# EAGLE design v2 (EAGLE 9.3.2)

## Sheet 1 of 6
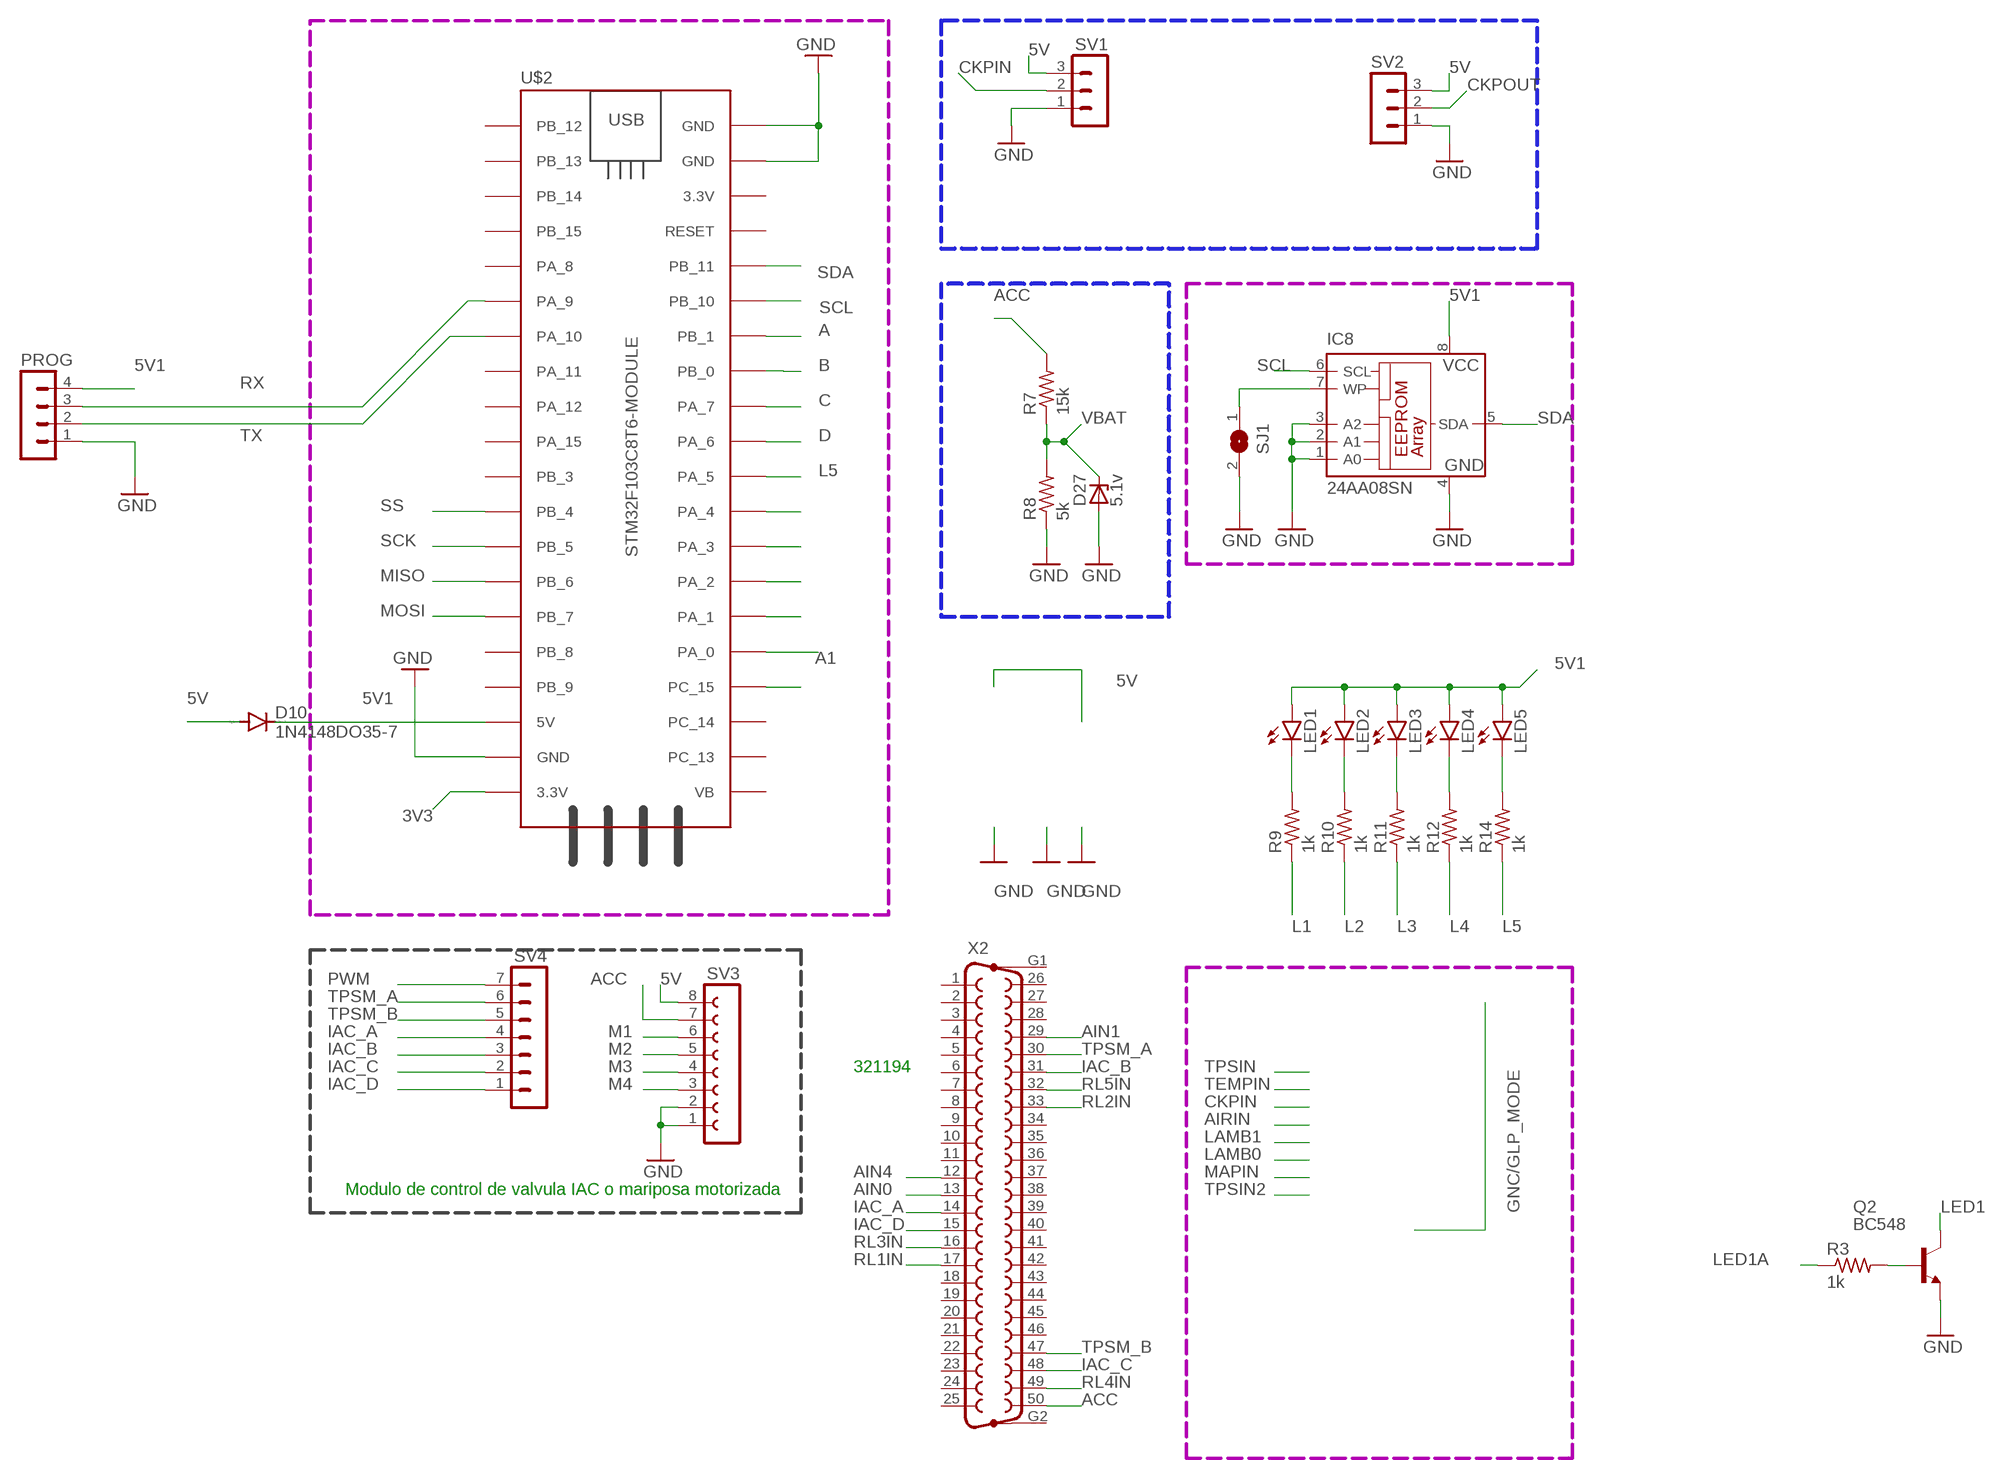
[diagram p0: schematic, sheet 1]

### Parts
D10  1N4148DO35-7  [DO35-7]
D27  5.1v  ZENER-DIODEZD-5  [ZDIO-5]
IC8  24AA08SN  [SO-08]
LED1  LED3MM  [LED3MM]
LED2  LED3MM  [LED3MM]
LED3  LED3MM  [LED3MM]
LED4  LED3MM  [LED3MM]
LED5  LED3MM  [LED3MM]
PROG  MA04-1  [MA04-1]
Q2  BC548  [TO92-EBC]
R3  1k  R-US_0204/5  [0204/5]
R7  15k  R-US_0204/5  [0204/5]
R8  5k  R-US_0204/5  [0204/5]
R9  1k  R-US_0204/5  [0204/5]
R10  1k  R-US_0204/5  [0204/5]
R11  1k  R-US_0204/5  [0204/5]
R12  1k  R-US_0204/5  [0204/5]
R14  1k  R-US_0204/5  [0204/5]
SJ1  SJW  [SJW]
SV1  MA03-1  [MA03-1]
SV2  MA03-1  [MA03-1]
SV3  FE08-1  [FE08]
SV4  MA07-1  [MA07-1]
U$2  STM32F103C8T6-MODULE  [STM32F103C8T6-MODULE]
X2  F50HP  [F50HP]

### Nets
3V3: U$2.3.3V_1(3.3V) ; also sheet 4
5V: D10.A SV1.3 SV2.3 SV3.8 ; also sheet 2,5,6
5V1: D10.C IC8.8(VCC) LED1.A LED2.A LED3.A LED4.A LED5.A PROG.4 U$2.5V
A: U$2.PB_1 ; also sheet 2
A1: U$2.PA_0 ; also sheet 4
ACC: R7.2 SV3.7 X2.50 ; also sheet 3,4,6
AIN0: X2.13 ; also sheet 5
AIN1: X2.29 ; also sheet 5
AIN4: X2.12 ; also sheet 5
B: U$2.PB_0 ; also sheet 2
C: U$2.PA_7 ; also sheet 2
CKPIN: SV1.2
CKPOUT: SV2.2 ; also sheet 2
D: U$2.PA_6 ; also sheet 2
GND: D27.A IC8.1(A0) IC8.2(A1) IC8.3(A2) IC8.4(GND) PROG.1 Q2.E R8.1 SJ1.2 SV1.1 SV2.1 SV3.1 SV3.2 U$2.GND_1(GND) U$2.GND_2(GND) U$2.GND_3(GND) ; also sheet 2,3,4,5,6
IAC_A: SV4.4 X2.14
IAC_B: SV4.3 X2.31
IAC_C: SV4.2 X2.48
IAC_D: SV4.1 X2.15
L1: R9.1
L2: R10.1
L3: R11.1
L4: R12.1
L5: R14.1 U$2.PA_5
LED1: Q2.C
LED1A: R3.1
M1: SV3.6 ; also sheet 2
M2: SV3.5 ; also sheet 2
M3: SV3.4 ; also sheet 2
M4: SV3.3 ; also sheet 2
MISO: U$2.PB_6 ; also sheet 2
MOSI: U$2.PB_7 ; also sheet 2
N$12: LED1.K(C) R9.2
N$13: LED2.K(C) R10.2
N$14: Q2.B R3.2
N$15: LED3.K(C) R11.2
N$16: LED4.K(C) R12.2
N$17: LED5.K(C) R14.2
N$21: U$2.PC_15
N$22: U$2.PA_1
N$23: U$2.PA_2
N$24: U$2.PA_3
N$26: U$2.PA_4
N$34: IC8.7(WP) SJ1.1
PWM: SV4.7 ; also sheet 2
RL1IN: X2.17 ; also sheet 4
RL2IN: X2.33 ; also sheet 4
RL3IN: X2.16 ; also sheet 4
RL4IN: X2.49 ; also sheet 4
RL5IN: X2.32 ; also sheet 4
RX: PROG.3 U$2.PA_9
SCK: U$2.PB_5 ; also sheet 2
SCL: IC8.6(SCL) U$2.PB_10 ; also sheet 2
SDA: IC8.5(SDA) U$2.PB_11 ; also sheet 2
SS: U$2.PB_4 ; also sheet 2
TPSM_A: SV4.6 X2.30
TPSM_B: SV4.5 X2.47
TX: PROG.2 U$2.PA_10
VBAT: D27.C R7.1 R8.2 ; also sheet 2
Unconnected: U$2.3.3V_2(3.3V) U$2.PA_8 U$2.PA_11 U$2.PA_12 U$2.PA_15 U$2.PB_3 U$2.PB_8 U$2.PB_9 U$2.PB_12 U$2.PB_13 U$2.PB_14 U$2.PB_15 U$2.PC_13 U$2.PC_14 U$2.RESET U$2.VB X2.1 X2.2 X2.3 X2.4 X2.5 X2.6 X2.7 X2.8 X2.9 X2.10 X2.11 X2.18 X2.19 X2.20 X2.21 X2.22 X2.23 X2.24 X2.25 X2.26 X2.27 X2.28 X2.34 X2.35 X2.36 X2.37 X2.38 X2.39 X2.40 X2.41 X2.42 X2.43 X2.44 X2.45 X2.46 X2.G1 X2.G2

### Notes on the sheet
- 321194
- Modulo de control de valvula IAC o mariposa motorizada

## Sheet 2 of 6: IO Principal
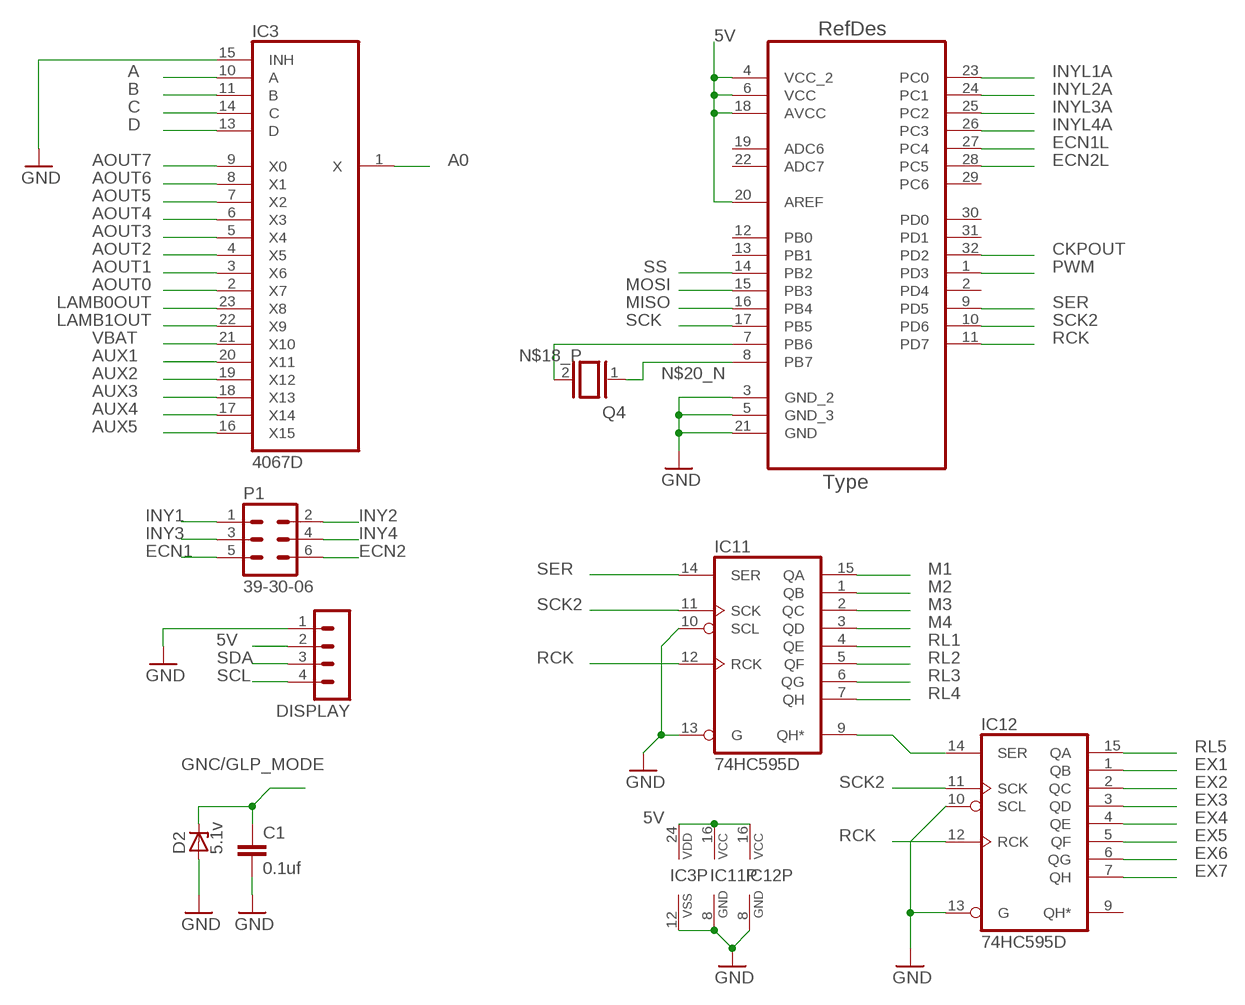
[diagram p1: schematic, sheet 2]

### Parts
C1  0.1uf  C-EU025-025X050  [C025-025X050]
D2  5.1v  ZENER-DIODEZD-5  [ZDIO-5]
DISPLAY  MA04-1  [MA04-1]
IC3  4067D  [SO24W]
IC11  74HC595D  [SO16]
IC12  74HC595D  [SO16]
P1  39-30-06  [39-30-?06?]
Q4  XTAL/S  [QS]
U1  ATMEGA328P-AU  [QFP80P900X900X120-32N]

### Nets
5V: DISPLAY.2 IC3.24(VDD) IC11.16(VCC) IC12.16(VCC) U1.4(VCC_2) U1.6(VCC) U1.18(AVCC) U1.20(AREF) ; also sheet 1,5,6
A: IC3.10(A) ; also sheet 1
A0: IC3.1(X) ; also sheet 4
AOUT0: IC3.2(X7) ; also sheet 5
AOUT1: IC3.3(X6) ; also sheet 5
AOUT2: IC3.4(X5) ; also sheet 5
AOUT3: IC3.5(X4) ; also sheet 5
AOUT4: IC3.6(X3) ; also sheet 5
AOUT5: IC3.7(X2) ; also sheet 5
AOUT6: IC3.8(X1) ; also sheet 5
AOUT7: IC3.9(X0) ; also sheet 5
AUX1: IC3.20(X11)
AUX2: IC3.19(X12)
AUX3: IC3.18(X13)
AUX4: IC3.17(X14)
AUX5: IC3.16(X15)
B: IC3.11(B) ; also sheet 1
C: IC3.14(C) ; also sheet 1
CKPOUT: U1.32(PD2) ; also sheet 1
D: IC3.13(D) ; also sheet 1
ECN1: P1.5 ; also sheet 3
ECN1L: U1.27(PC4) ; also sheet 3
ECN2: P1.6 ; also sheet 3
ECN2L: U1.28(PC5) ; also sheet 3
EX1: IC12.1(QB)
EX2: IC12.2(QC)
EX3: IC12.3(QD)
EX4: IC12.4(QE)
EX5: IC12.5(QF)
EX6: IC12.6(QG)
EX7: IC12.7(QH)
GNC/GLP_MODE: C1.1 D2.C ; also sheet 1
GND: C1.2 D2.A DISPLAY.1 IC3.12(VSS) IC3.15(INH) IC11.8(GND) IC11.10(SCL) IC11.13(G) IC12.8(GND) IC12.10(SCL) IC12.13(G) U1.3(GND_2) U1.5(GND_3) U1.21(GND) ; also sheet 1,3,4,5,6
INY1: P1.1 ; also sheet 3
INY2: P1.2 ; also sheet 3
INY3: P1.3 ; also sheet 3
INY4: P1.4 ; also sheet 3
INYL1A: U1.23(PC0) ; also sheet 3
INYL2A: U1.24(PC1) ; also sheet 3
INYL3A: U1.25(PC2) ; also sheet 3
INYL4A: U1.26(PC3) ; also sheet 3
LAMB0OUT: IC3.23(X8) ; also sheet 5
LAMB1OUT: IC3.22(X9) ; also sheet 5
M1: IC11.15(QA) ; also sheet 1
M2: IC11.1(QB) ; also sheet 1
M3: IC11.2(QC) ; also sheet 1
M4: IC11.3(QD) ; also sheet 1
MISO: U1.16(PB4) ; also sheet 1
MOSI: U1.15(PB3) ; also sheet 1
N$18_P: Q4.2 U1.7(PB6)
N$20_N: Q4.1 U1.8(PB7)
N$25: IC11.9(QH*) IC12.14(SER)
PWM: U1.1(PD3) ; also sheet 1
RCK: IC11.12(RCK) IC12.12(RCK) U1.11(PD7)
RL1: IC11.4(QE) ; also sheet 4
RL2: IC11.5(QF) ; also sheet 4
RL3: IC11.6(QG) ; also sheet 4
RL4: IC11.7(QH) ; also sheet 4
RL5: IC12.15(QA) ; also sheet 4
SCK: U1.17(PB5) ; also sheet 1
SCK2: IC11.11(SCK) IC12.11(SCK) U1.10(PD6)
SCL: DISPLAY.4 ; also sheet 1
SDA: DISPLAY.3 ; also sheet 1
SER: IC11.14(SER) U1.9(PD5)
SS: U1.14(PB2) ; also sheet 1
VBAT: IC3.21(X10) ; also sheet 1
Unconnected: IC12.9(QH*) U1.2(PD4) U1.12(PB0) U1.13(PB1) U1.19(ADC6) U1.22(ADC7) U1.29(PC6) U1.30(PD0) U1.31(PD1)

## Sheet 3 of 6: Inyectores/Encendido
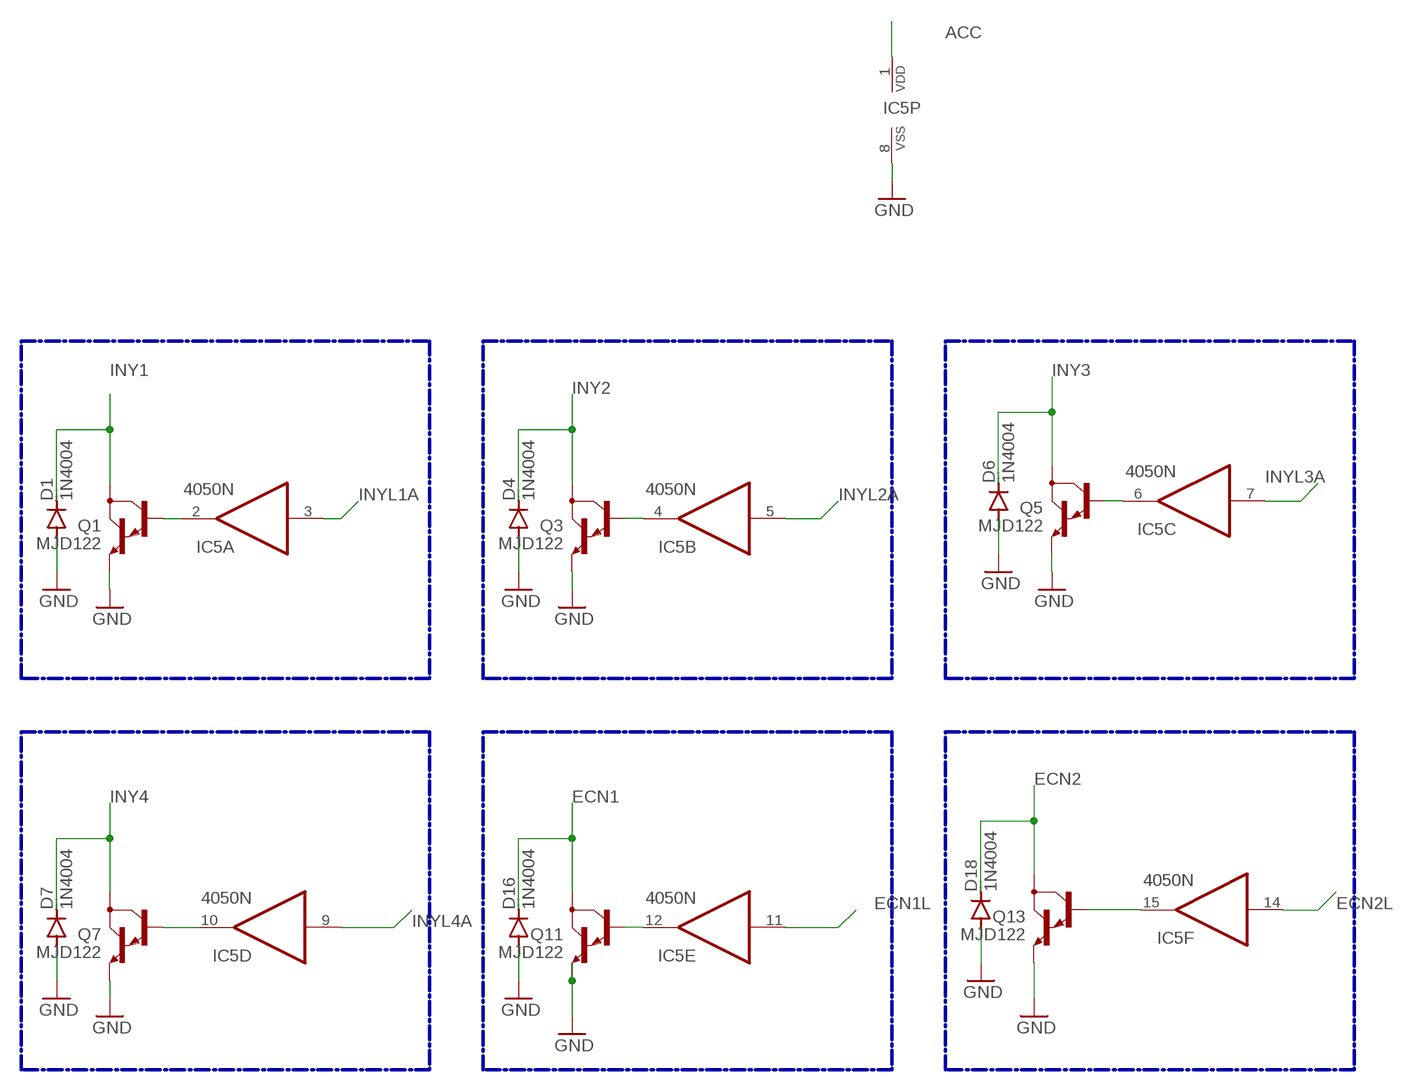
[diagram p2: schematic, sheet 3]

### Parts
D1  1N4004  [DO41-10]
D4  1N4004  [DO41-10]
D6  1N4004  [DO41-10]
D7  1N4004  [DO41-10]
D16  1N4004  [DO41-10]
D18  1N4004  [DO41-10]
IC5  4050N  [DIL16]
Q1  MJD122  [DPAK]
Q3  MJD122  [DPAK]
Q5  MJD122  [DPAK]
Q7  MJD122  [DPAK]
Q11  MJD122  [DPAK]
Q13  MJD122  [DPAK]

### Nets
ACC: IC5.1(P:VDD) ; also sheet 1,4,6
ECN1: D16.C Q11.4(C) ; also sheet 2
ECN1L: IC5.11(E:I) ; also sheet 2
ECN2: D18.C Q13.4(C) ; also sheet 2
ECN2L: IC5.14(F:I) ; also sheet 2
GND: D1.A D4.A D6.A D7.A D16.A D18.A IC5.8(P:VSS) Q1.3(E) Q3.3(E) Q5.3(E) Q7.3(E) Q11.3(E) Q13.3(E) ; also sheet 1,2,4,5,6
INY1: D1.C Q1.4(C) ; also sheet 2
INY2: D4.C Q3.4(C) ; also sheet 2
INY3: D6.C Q5.4(C) ; also sheet 2
INY4: D7.C Q7.4(C) ; also sheet 2
INYL1A: IC5.3(A:I) ; also sheet 2
INYL2A: IC5.5(B:I) ; also sheet 2
INYL3A: IC5.7(C:I) ; also sheet 2
INYL4A: IC5.9(D:I) ; also sheet 2
N$2: IC5.2(A:O) Q1.1(B)
N$3: IC5.4(B:O) Q3.1(B)
N$5: IC5.6(C:O) Q5.1(B)
N$6: IC5.10(D:O) Q7.1(B)
N$9: IC5.12(E:O) Q11.1(B)
N$10: IC5.15(F:O) Q13.1(B)

### Buses
B$1

## Sheet 4 of 6: Relay
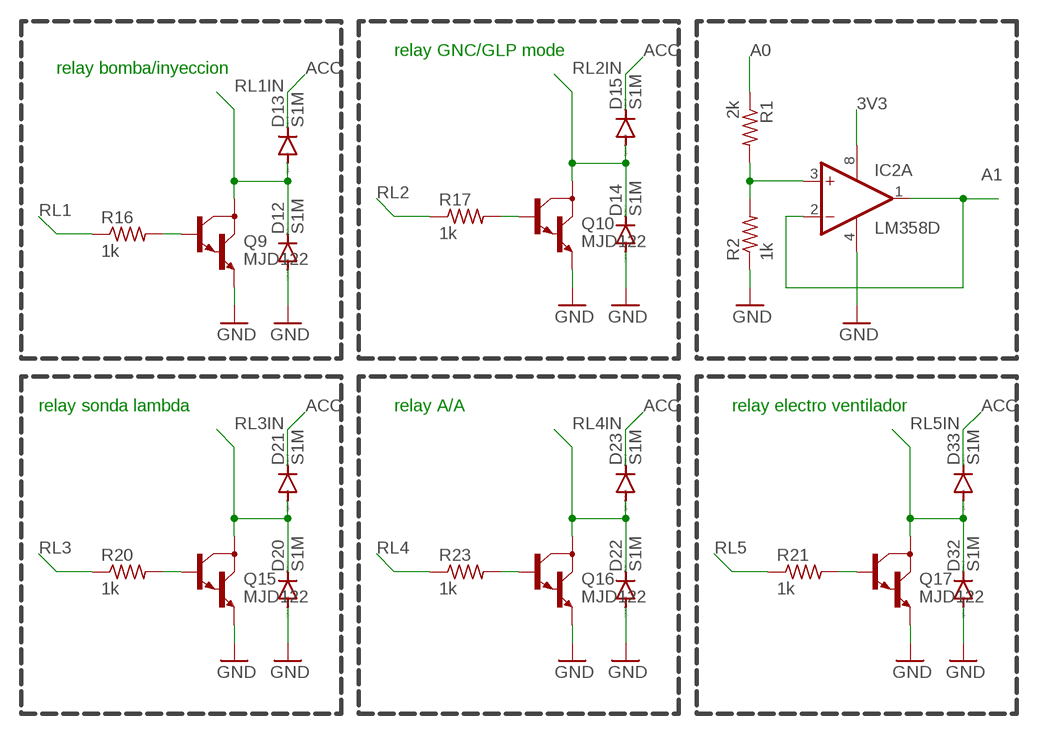
[diagram p3: schematic, sheet 4]

### Parts
D12  S1M  [SMA]
D13  S1M  [SMA]
D14  S1M  [SMA]
D15  S1M  [SMA]
D20  S1M  [SMA]
D21  S1M  [SMA]
D22  S1M  [SMA]
D23  S1M  [SMA]
D32  S1M  [SMA]
D33  S1M  [SMA]
IC2  LM358D  [SO08]
Q9  MJD122  [DPAK]
Q10  MJD122  [DPAK]
Q15  MJD122  [DPAK]
Q16  MJD122  [DPAK]
Q17  MJD122  [DPAK]
R1  2k  R-US_0204/5  [0204/5]
R2  1k  R-US_0204/5  [0204/5]
R16  1k  R-US_0204/5  [0204/5]
R17  1k  R-US_0204/5  [0204/5]
R20  1k  R-US_0204/5  [0204/5]
R21  1k  R-US_0204/5  [0204/5]
R23  1k  R-US_0204/5  [0204/5]

### Nets
3V3: IC2.8(P:V+) ; also sheet 1
A0: R1.1 ; also sheet 2
A1: IC2.1(A:OUT) IC2.2(A:-IN) ; also sheet 1
ACC: D13.C D15.C D21.C D23.C D33.C ; also sheet 1,3,6
GND: D12.A D14.A D20.A D22.A D32.A IC2.4(P:V-) Q9.3(E) Q10.3(E) Q15.3(E) Q16.3(E) Q17.3(E) R2.1 ; also sheet 1,2,3,5,6
N$4: Q9.1(B) R16.2
N$7: Q17.1(B) R21.2
N$8: Q10.1(B) R17.2
N$11: IC2.3(A:+IN) R1.2 R2.2
N$19: Q15.1(B) R20.2
N$29: Q16.1(B) R23.2
RL1: R16.1 ; also sheet 2
RL1IN: D12.C D13.A Q9.4(C) ; also sheet 1
RL2: R17.1 ; also sheet 2
RL2IN: D14.C D15.A Q10.4(C) ; also sheet 1
RL3: R20.1 ; also sheet 2
RL3IN: D20.C D21.A Q15.4(C) ; also sheet 1
RL4: R23.1 ; also sheet 2
RL4IN: D22.C D23.A Q16.4(C) ; also sheet 1
RL5: R21.1 ; also sheet 2
RL5IN: D32.C D33.A Q17.4(C) ; also sheet 1
Unconnected: IC2.5(B:+IN) IC2.6(B:-IN) IC2.7(B:OUT)

### Notes on the sheet
- relay GNC/GLP mode
- relay bomba/inyeccion
- relay sonda lambda | relay A/A | relay electro ventilador

## Sheet 5 of 6: Sensores
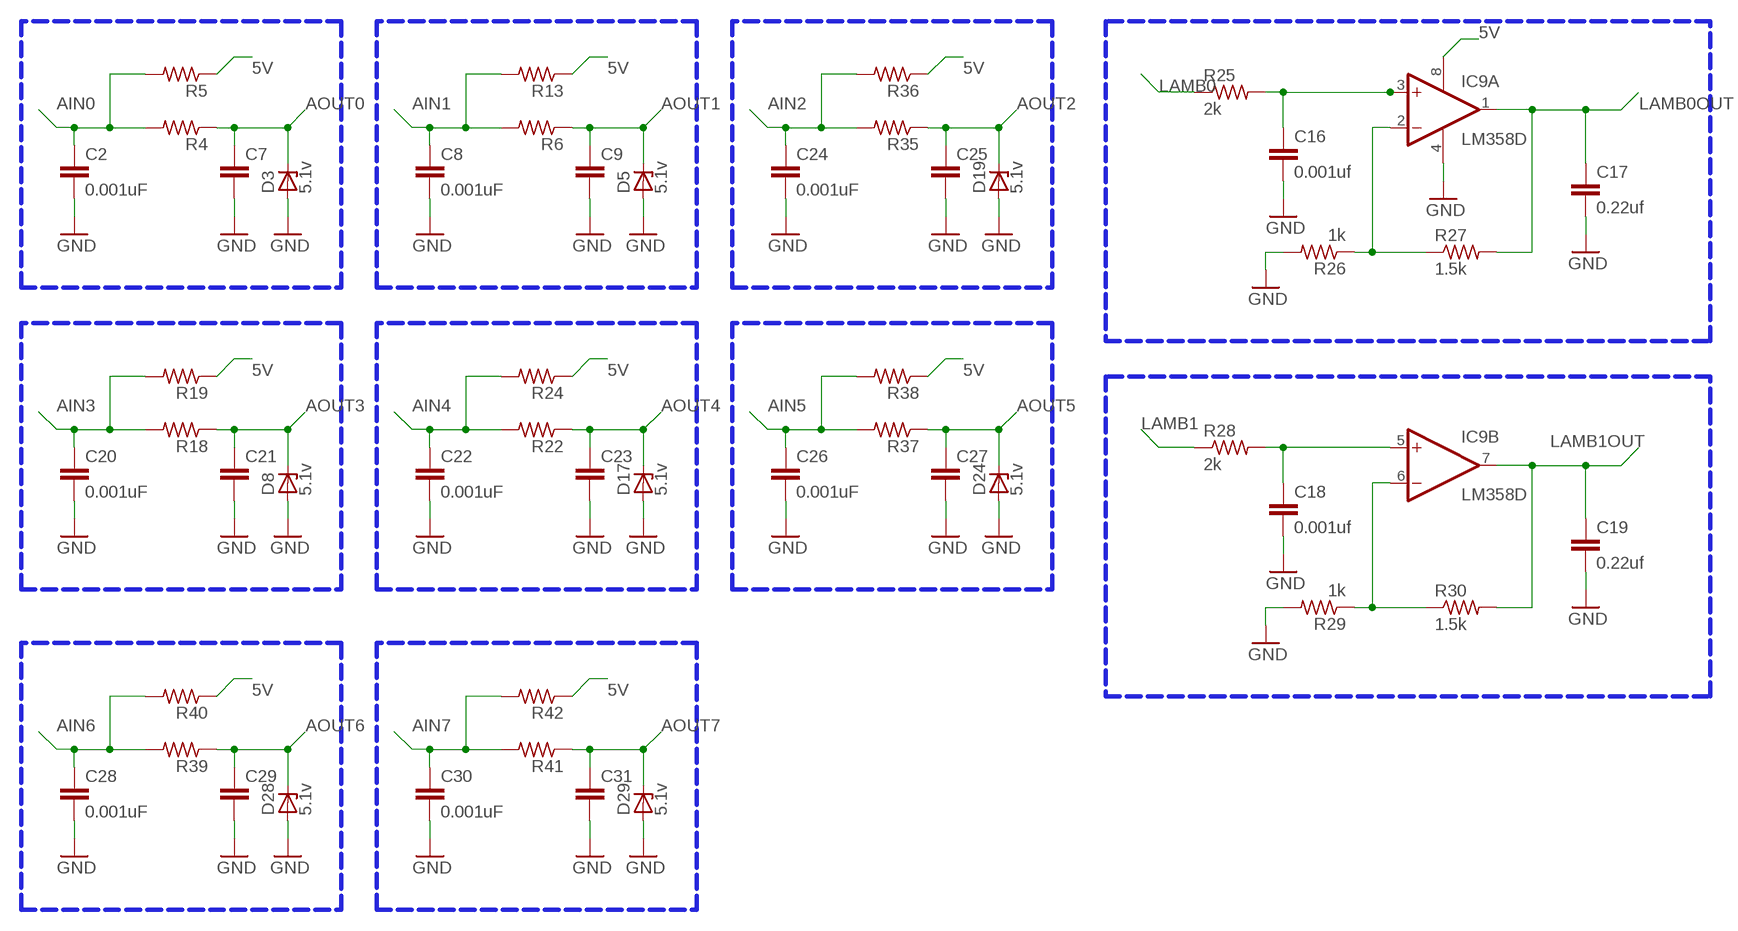
[diagram p4: schematic, sheet 5]

### Parts
C2  0.001uF  C-EU025-025X050  [C025-025X050]
C7  C-EU025-025X050  [C025-025X050]
C8  0.001uF  C-EU025-025X050  [C025-025X050]
C9  C-EU025-025X050  [C025-025X050]
C16  0.001uf  C-EU025-025X050  [C025-025X050]
C17  0.22uf  C-EU025-025X050  [C025-025X050]
C18  0.001uf  C-EU025-025X050  [C025-025X050]
C19  0.22uf  C-EU025-025X050  [C025-025X050]
C20  0.001uF  C-EU025-025X050  [C025-025X050]
C21  C-EU025-025X050  [C025-025X050]
C22  0.001uF  C-EU025-025X050  [C025-025X050]
C23  C-EU025-025X050  [C025-025X050]
C24  0.001uF  C-EU025-025X050  [C025-025X050]
C25  C-EU025-025X050  [C025-025X050]
C26  0.001uF  C-EU025-025X050  [C025-025X050]
C27  C-EU025-025X050  [C025-025X050]
C28  0.001uF  C-EU025-025X050  [C025-025X050]
C29  C-EU025-025X050  [C025-025X050]
C30  0.001uF  C-EU025-025X050  [C025-025X050]
C31  C-EU025-025X050  [C025-025X050]
D3  5.1v  ZENER-DIODEZD-5  [ZDIO-5]
D5  5.1v  ZENER-DIODEZD-5  [ZDIO-5]
D8  5.1v  ZENER-DIODEZD-5  [ZDIO-5]
D17  5.1v  ZENER-DIODEZD-5  [ZDIO-5]
D19  5.1v  ZENER-DIODEZD-5  [ZDIO-5]
D24  5.1v  ZENER-DIODEZD-5  [ZDIO-5]
D28  5.1v  ZENER-DIODEZD-5  [ZDIO-5]
D29  5.1v  ZENER-DIODEZD-5  [ZDIO-5]
IC9  LM358D  [SO08]
R4  R-US_0204/5  [0204/5]
R5  R-US_0204/5  [0204/5]
R6  R-US_0204/5  [0204/5]
R13  R-US_0204/5  [0204/5]
R18  R-US_0204/5  [0204/5]
R19  R-US_0204/5  [0204/5]
R22  R-US_0204/5  [0204/5]
R24  R-US_0204/5  [0204/5]
R25  2k  R-US_0204/5  [0204/5]
R26  1k  R-US_0204/5  [0204/5]
R27  1.5k  R-US_0204/5  [0204/5]
R28  2k  R-US_0204/5  [0204/5]
R29  1k  R-US_0204/5  [0204/5]
R30  1.5k  R-US_0204/5  [0204/5]
R35  R-US_0204/5  [0204/5]
R36  R-US_0204/5  [0204/5]
R37  R-US_0204/5  [0204/5]
R38  R-US_0204/5  [0204/5]
R39  R-US_0204/5  [0204/5]
R40  R-US_0204/5  [0204/5]
R41  R-US_0204/5  [0204/5]
R42  R-US_0204/5  [0204/5]

### Nets
5V: IC9.8(P:V+) R5.1 R13.1 R19.1 R24.1 R36.1 R38.1 R40.1 R42.1 ; also sheet 1,2,6
AIN0: C2.1 R4.2 R5.2 ; also sheet 1
AIN1: C8.1 R6.2 R13.2 ; also sheet 1
AIN2: C24.1 R35.2 R36.2
AIN3: C20.1 R18.2 R19.2
AIN4: C22.1 R22.2 R24.2 ; also sheet 1
AIN5: C26.1 R37.2 R38.2
AIN6: C28.1 R39.2 R40.2
AIN7: C30.1 R41.2 R42.2
AOUT0: C7.1 D3.C R4.1 ; also sheet 2
AOUT1: C9.1 D5.C R6.1 ; also sheet 2
AOUT2: C25.1 D19.C R35.1 ; also sheet 2
AOUT3: C21.1 D8.C R18.1 ; also sheet 2
AOUT4: C23.1 D17.C R22.1 ; also sheet 2
AOUT5: C27.1 D24.C R37.1 ; also sheet 2
AOUT6: C29.1 D28.C R39.1 ; also sheet 2
AOUT7: C31.1 D29.C R41.1 ; also sheet 2
GND: C2.2 C7.2 C8.2 C9.2 C16.2 C17.2 C18.2 C19.2 C20.2 C21.2 C22.2 C23.2 C24.2 C25.2 C26.2 C27.2 C28.2 C29.2 C30.2 C31.2 D3.A D5.A D8.A D17.A D19.A D24.A D28.A D29.A IC9.4(P:V-) R26.2 R29.2 ; also sheet 1,2,3,4,6
LAMB0: R25.1 ; also sheet 1
LAMB0OUT: C17.1 IC9.1(A:OUT) R27.2 ; also sheet 2
LAMB1: R28.1 ; also sheet 1
LAMB1OUT: C19.1 IC9.7(B:OUT) R30.2 ; also sheet 2
N$1: C18.1 IC9.5(B:+IN) R28.2
N$31: C16.1 IC9.3(A:+IN) R25.2
N$32: IC9.2(A:-IN) R26.1 R27.1
N$37: IC9.6(B:-IN) R29.1 R30.1

## Sheet 6 of 6: Fuente
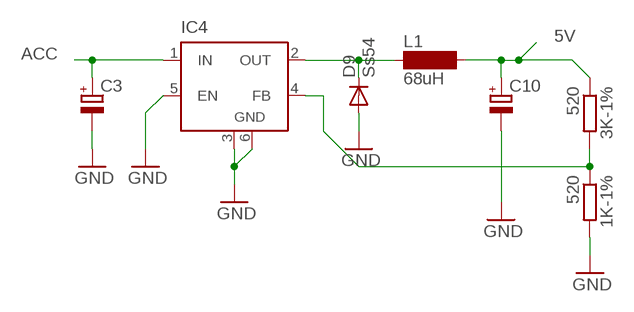
[diagram p5: schematic, sheet 6]

### Parts
1K-1%  520  R-EU_0204/7  [0204/7]
3K-1%  520  R-EU_0204/7  [0204/7]
C3  CPOL-EUE3.5-8  [E3,5-8]
C10  CPOL-EUE3.5-8  [E3,5-8]
D9  Ss54  S1A  [DO214AC]
IC4  LM2596S  [TO263-5]
L1  68uH  SD12-680  [SD12-680]

### Nets
5V: 3K-1%.1 C10.+ L1.2 ; also sheet 1,2,5
ACC: C3.+ IC4.1(IN) ; also sheet 1,3,4
GND: 1K-1%.2 C3.- C10.- D9.A IC4.3(GND) IC4.5(EN) IC4.6(GND) ; also sheet 1,2,3,4,5
N$91: D9.C IC4.2(OUT) L1.1
N$92: 1K-1%.1 3K-1%.2 IC4.4(FB)

## Library data of the parts
1K-1% 3K-1% = rcl:R-EU_: RESISTOR, European symbol; SPICEPREFIX: R
C1 C2 C7-C9 C16-C31 = rcl:C-EU: CAPACITOR, European symbol; SPICEPREFIX: C
C3 C10 = rcl:CPOL-EU: POLARIZED CAPACITOR, European symbol; SPICEPREFIX: C
D1 D4 D6 D7 D16 D18 = diode:1N4004: DIODE general purpose rectifier, 1 A
D2 D3 D5 D8 D17 D19 D24 D27-D29 = diode:ZENER-DIODE: Z-Diode
D9 = s1x_10:S1*: S1A - S1M General Purpose Rectifiers Source: http://www.fairchildsemi.com/datasheets/S1/S1A.pdf; MF: Fairchild; MPN: S1A; OC_FARNELL: 9843868; OC_NEWARK: 58K9551
D10 = diode:1N4148: DIODE high speed (Philips)
D12-D15 D20-D23 D32 D33 = diode:S1M
DISPLAY PROG = con-lstb:MA04-1: PIN HEADER; OC_FARNELL: unknown; OC_NEWARK: unknown
IC2 IC9 = linear:LM358: OP AMP also LM158; LM258; LM2904 Source: http://cache.national.com/ds/LM/LM158.pdf
IC3 = 40xx:4067: 16-channel ANALOG MULTIPLEXER
IC4 = linear:LM2596S: STEP-DOWN VOLTAGE REGULATOR
IC5 = 40xx:4050: Hex non-inverting BUFFER
IC8 = microchip:24*: Serial EEPROM I2C; MF: MICROCHIP; MPN: 24AA08-I/SN; OC_FARNELL: 1579568; OC_NEWARK: 92C6826
IC11 IC12 = 74xx-eu:74*595: 8-bit SHIFT REGISTER, output latch
L1 = inductor-neosid:SD12: INDUCTOR nominal inductance; MF: BUSSMANN; MPN: SD12-680; OC_FARNELL: unknown; OC_NEWARK: 19K7201
LED1-LED5 = led:LED: LED OSRAM: - CHIPLED LG R971, LG N971, LY N971, LG Q971, LY Q971, LO R971, LY R971 LH N974, LH R974 LS Q976, LO Q976, LY Q976 LO Q996 - Hyper CHIPLED LW Q18S LB Q993, LB Q99A, LB R99A - SideLED LS A670, LO A670, LY A670, LG A670, LP A670 LB A673, LV A673, LT A673, LW A673 LH A674 LY A675 LS A676, LA A676, LO A676, LY A676, LW A676 LS A679, LY A679, LG A679 - Hyper Micro SIDELED® LS Y876, LA Y876, LO Y876, LY Y876 LT Y87S - SmartLED LW L88C, LW L88S LB L89C, LB L89S, LG L890 LS L89K, LO L89K, LY L89K LS L896, LA L896, LO L896, LY L896 - TOPLED LS T670, LO T670, LY T670, LG T670, LP T670 LSG T670, LSP T670, LSY T670, LOP T670, LYG T670 LG T671, LOG T671, LSG T671 LB T673, LV T673, LT T673, LW T673 LH T674 LS T676, LA T676, LO T676, LY T676, LB T676, LH T676, LSB T676, LW T676 LB T67C, LV T67C, LT T67C, LS T67K, LO T67K, LY T67K, LW E67C LS E67B, LA E67B, LO E67B, LY E67B, LB E67C, LV E67C, LT E67C LW T67C LS T679, LY T679, LG T679 LS T770, LO T770, LY T770, LG T770, LP T770 LB T773, LV T773, LT T773, LW T773 LH T774 LS E675, LA E675, LY E675, LS T675 LS T776, LA T776, LO T776, LY T776, LB T776 LHGB T686 LT T68C, LB T68C - Hyper Mini TOPLED® LB M676 - Mini TOPLED Santana® LG M470 LS M47K, LO M47K, LY M47K Source: http://www.osram.convergy.de LUXEON: - LUMILED® LXK2-PW12-R00, LXK2-PW12-S00, LXK2-PW14-U00, LXK2-PW14-V00 LXK2-PM12-R00, LXK2-PM12-S00, LXK2-PM14-U00 LXK2-PE12-Q00, LXK2-PE12-R00, LXK2-PE12-S00, LXK2-PE14-T00, LXK2-PE14-U00 LXK2-PB12-K00, LXK2-PB12-L00, LXK2-PB12-M00, LXK2-PB14-N00, LXK2-PB14-P00, LXK2-PB14-Q00 LXK2-PR12-L00, LXK2-PR12-M00, LXK2-PR14-Q00, LXK2-PR14-R00 LXK2-PD12-Q00, LXK2-PD12-R00, LXK2-PD12-S00 LXK2-PH12-R00, LXK2-PH12-S00 LXK2-PL12-P00, LXK2-PL12-Q00, LXK2-PL12-R00 Source: www.luxeon.com KINGBRIGHT: KA-3528ASYC Source: www.kingbright.com
P1 = con-molex-mini-fit:39-30-?06?: HEADER
Q1 Q3 Q5 Q7 Q9-Q11 Q13 Q15-Q17 = MJD122:MJD122: TRANS DARL NPN 100V 5A DPAK; AVAILABILITY: Unavailable; MF: STMicroelectronics; MP: MJD122; PACKAGE: None; PRICE: None
Q2 = transistor-npn:BC548*: NPN Transistor
Q4 = special:XTAL/S: CRYSTAL
R1-R14 R16-R30 R35-R42 = rcl:R-US_: RESISTOR, American symbol; SPICEPREFIX: R
SJ1 = jumper:SJ: SMD solder JUMPER
SV1 SV2 = con-lstb:MA03-1: PIN HEADER; OC_FARNELL: unknown; OC_NEWARK: unknown
SV3 = con-lsta:FE08-1: FEMALE HEADER; OC_FARNELL: unknown; OC_NEWARK: unknown
SV4 = con-lstb:MA07-1: PIN HEADER; OC_FARNELL: unknown; OC_NEWARK: unknown
U1 = atmega328:ATMEGA328P-AU; DESCRIPTION: 8-bit Microcontroller with In-System Programmable Flash; MPN: ATMEGA328P-AU; OC_FARNELL: 1715486; OC_NEWARK: 14R4631; PACKAGE: TQFP-32; SUPPLIER: Atmel
U$2 = stm32f103c8t6_module:STM32F103C8T6-MODULE: STM32F103C8T6 module with ARM Cortex-3, 20kB SRAM, 64kB Flash, 72MHz
X2 = con-subd:F50HP: SUB-D; OC_FARNELL: unknown; OC_NEWARK: unknown

## Board
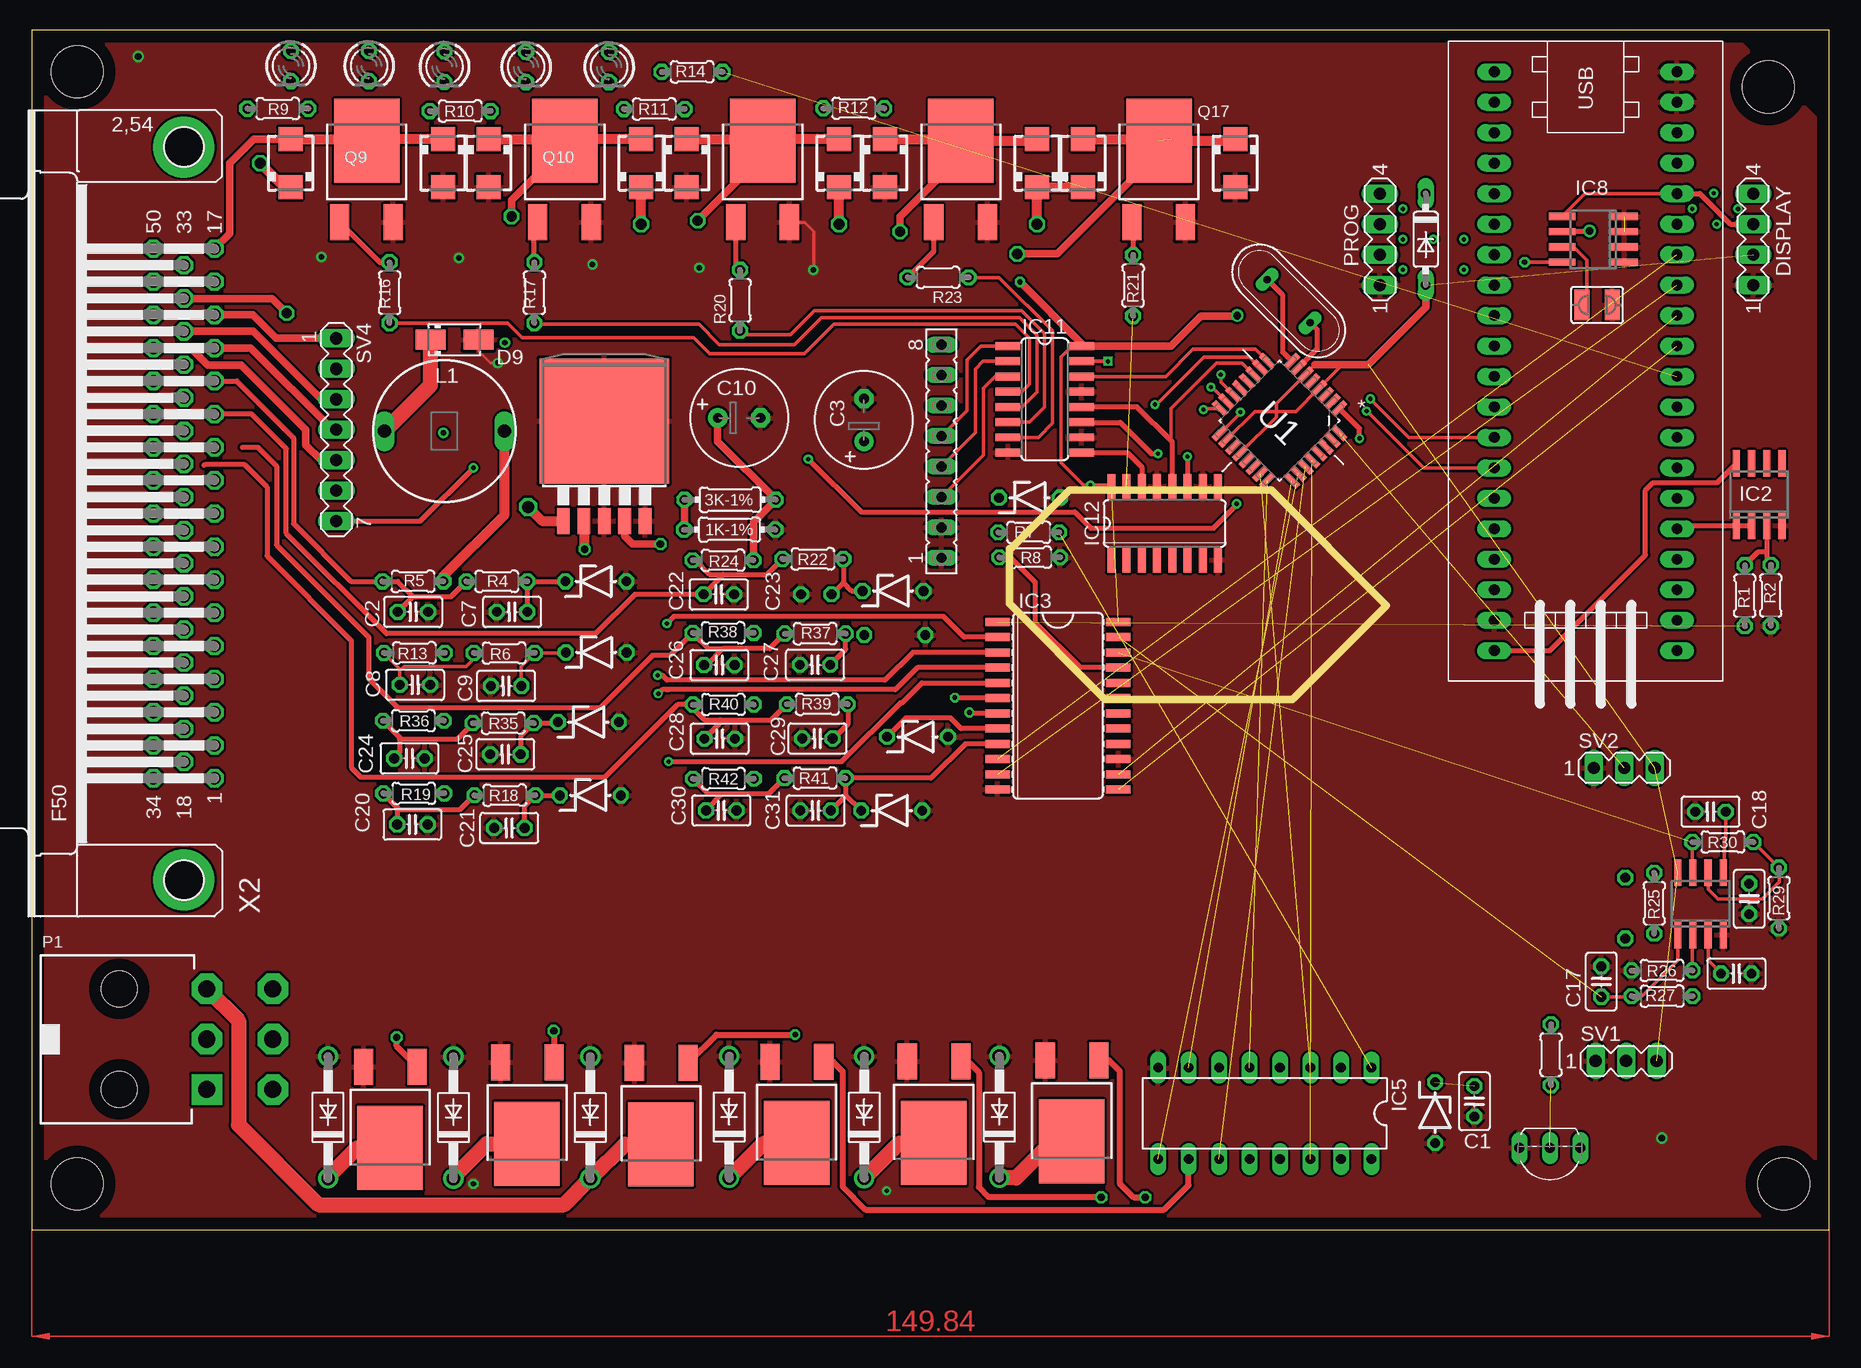
[diagram p6: board, top side]
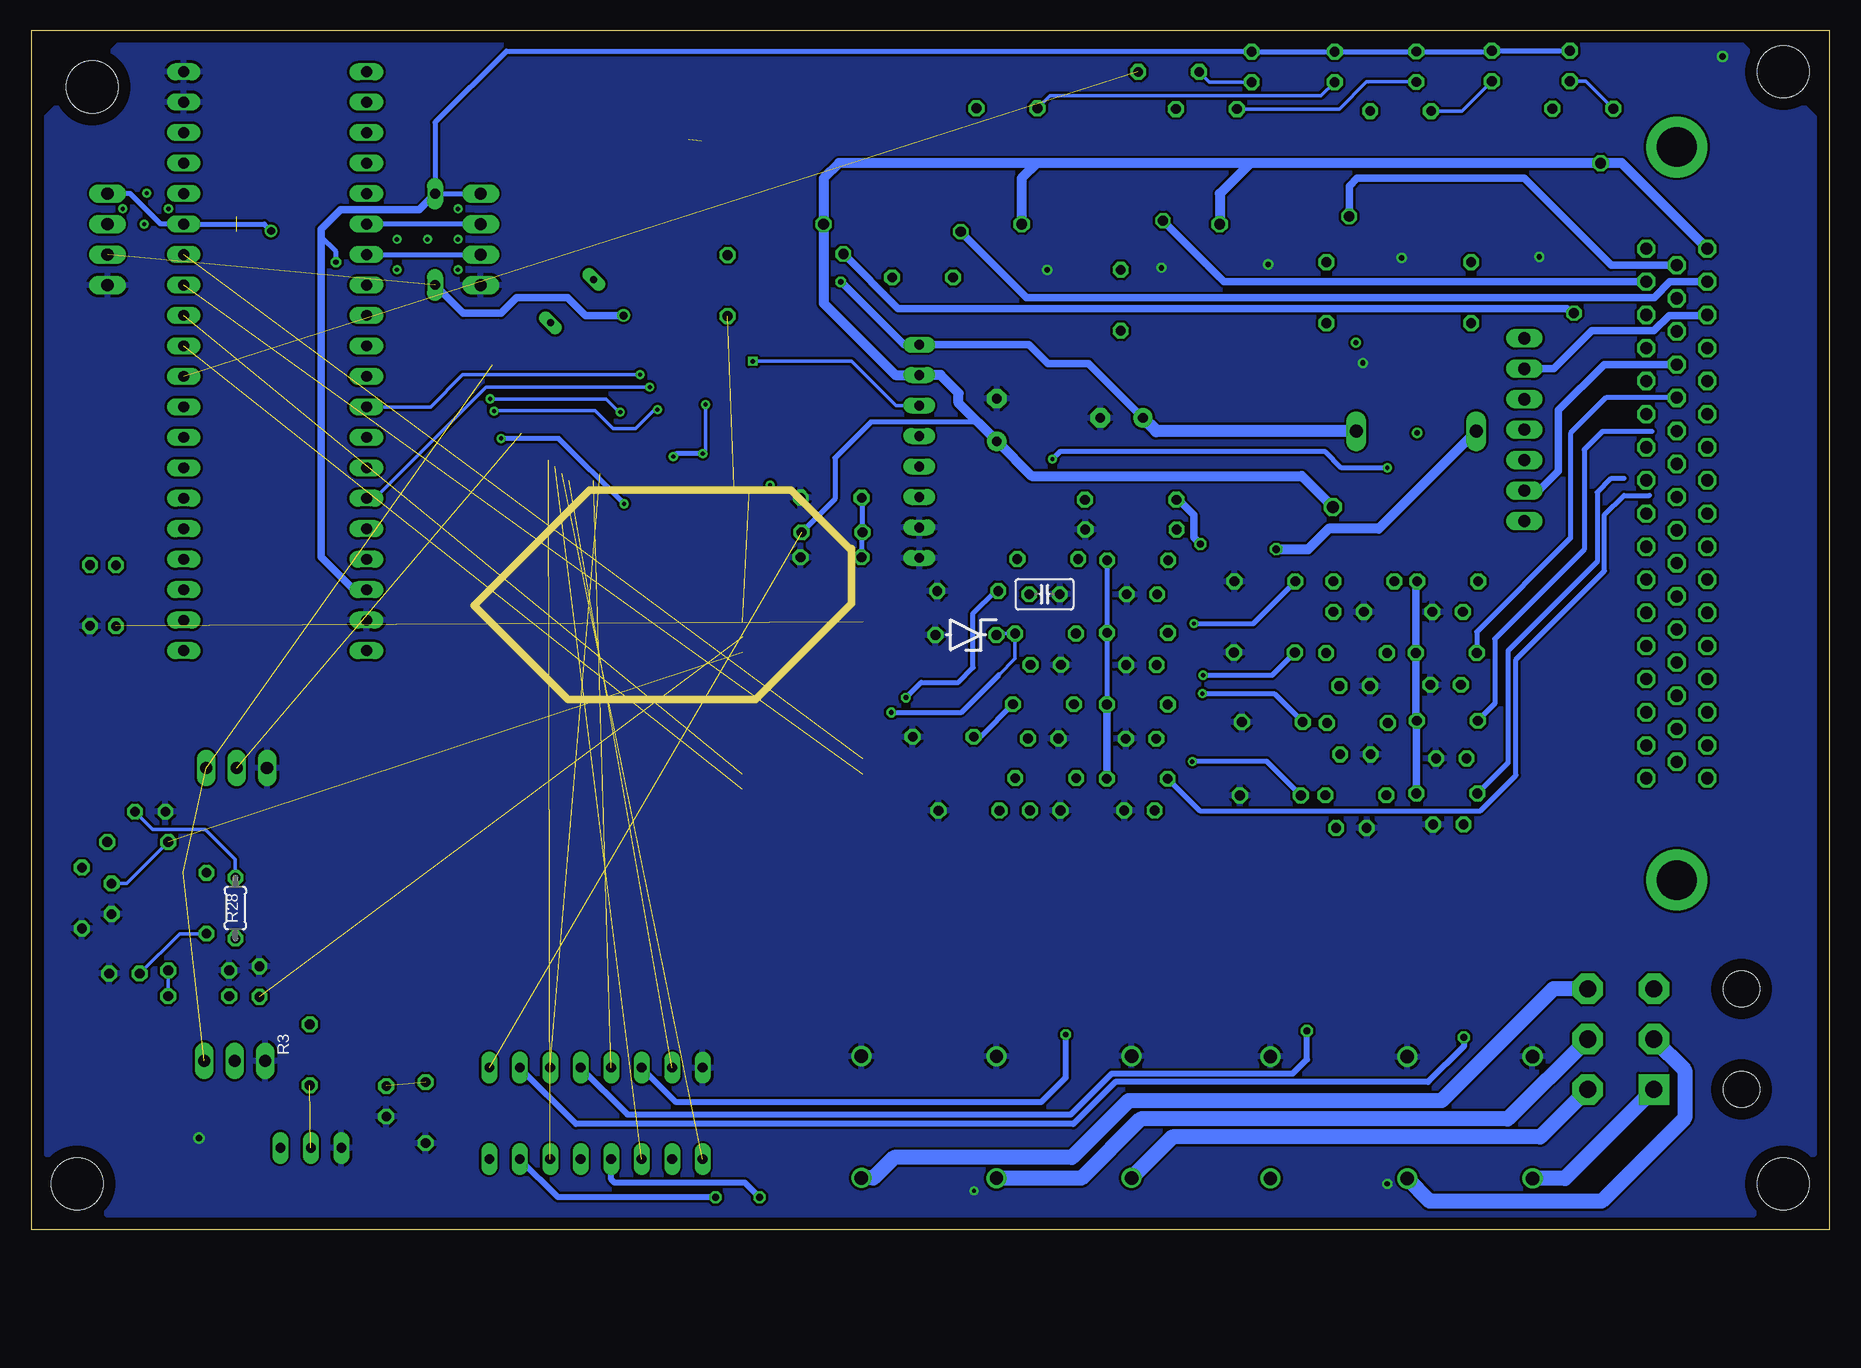
[diagram p7: board, bottom side, seen from below]

Size 149.84 x 100 mm. Coordinates in mm from the lower left corner, seen from the top.
Outline: 0,0 149.84,0 149.84,100 0,100 0,0
Copper layers (1*16): Top 0.035mm / dielectric 1.5mm / Bottom 0.035mm
Design rules "default *": minimum track width 8mil, minimum drill 0.35mm, track to track 8mil, track to pad 8mil, pad to pad 8mil, via to via 8mil, smd to smd 8mil, copper to edge 40mil, drill to drill 8mil, minimum pad ring 10mil, minimum via ring 8mil, stop-mask expansion 4mil, vias tented up to drill 0mil, thermal gap 10mil
Holes 4.32 mm at 144.78,95.25 146.05,3.81 3.81,3.81 3.81,96.52
vRestrict: 7 lines
Milling: 7 lines

### Footprints (pad centres in the part's own frame; a part is rotated, then mirrored left to right if it is on the bottom)
0204/7 = drill 0.813 octagon: 1 -3.81,0; 2 3.81,0
C025-025X050 = drill 0.813 octagon: 1 -1.27,0; 2 1.27,0
E3,5-8 = drill 0.813 pad 1.6: + -1.778,0 | drill 0.813 pad 1.6 octagon: - 1.778,0
DO41-10 = drill 1.118: A 5.08,0; C -5.08,0
ZDIO-5 = drill 0.813 octagon: A 2.54,0; C -2.54,0
DO214AC = smd 2.5 x 1.7: A 2,0; C -2,0
DO35-7 = drill 0.813 long: A 3.81,0; C -3.81,0
SMA = smd 2 x 2: A 2,0; C -2,0
MA04-1 = drill 1.016 long: 1 -3.81,0; 2 -1.27,0; 3 1.27,0; 4 3.81,0
SO08 = smd 0.6 x 2.2: 1 -1.905,-2.6; 2 -0.635,-2.6; 3 0.635,-2.6; 4 1.905,-2.6; 5 1.905,2.6; 6 0.635,2.6; 7 -0.635,2.6; 8 -1.905,2.6
SO24W = smd 0.66 x 2.032: 1 -6.985,-5.029; 2 -5.715,-5.029; 3 -4.445,-5.029; 4 -3.175,-5.029; 5 -1.905,-5.029; 6 -0.635,-5.029; 7 0.635,-5.029; 8 1.905,-5.029; 9 3.175,-5.029; 10 4.445,-5.029; 11 5.715,-5.029; 12 6.985,-5.029; 13 6.985,5.029; 14 5.715,5.029; 15 4.445,5.029; 16 3.175,5.029; 17 1.905,5.029; 18 0.635,5.029; 19 -0.635,5.029; 20 -1.905,5.029; 21 -3.175,5.029; 22 -4.445,5.029; 23 -5.715,5.029; 24 -6.985,5.029
TO263-5 = smd 1.067 x 2.159: 1 -3.404,-5.791; 2 -1.702,-5.791; 3 0,-5.791; 4 1.702,-5.791; 5 3.404,-5.791 | smd 10.8 x 10.41: 6 0,2.54
DIL16 = drill 0.813 long: 1 -8.89,-3.81; 2 -6.35,-3.81; 3 -3.81,-3.81; 4 -1.27,-3.81; 5 1.27,-3.81; 6 3.81,-3.81; 7 6.35,-3.81; 8 8.89,-3.81; 9 8.89,3.81; 10 6.35,3.81; 11 3.81,3.81; 12 1.27,3.81; 13 -1.27,3.81; 14 -3.81,3.81; 15 -6.35,3.81; 16 -8.89,3.81
SO-08 = smd 0.6 x 2.2: 1 -1.905,-2.6; 2 -0.635,-2.6; 3 0.635,-2.6; 4 1.905,-2.6; 5 1.905,2.6; 6 0.635,2.6; 7 -0.635,2.6; 8 -1.905,2.6
SO16 = smd 0.66 x 2.032: 1 -4.445,-3.073; 2 -3.175,-3.073; 3 -1.905,-3.073; 4 -0.635,-3.073; 5 0.635,-3.073; 6 1.905,-3.073; 7 3.175,-3.073; 8 4.445,-3.073; 9 4.445,3.073; 10 3.175,3.073; 11 1.905,3.073; 12 0.635,3.073; 13 -0.635,3.073; 14 -1.905,3.073; 15 -3.175,3.073; 16 -4.445,3.073
SD12-680 = drill 1.1 long: 1 -5,0; 2 5,0
LED3MM = drill 0.813 octagon: A -1.27,0; K 1.27,0
39-30-?06? = drill 1.422 pad 2.54 square: 1 4.191,0 | drill 1.422 pad 2.54 octagon: 2 0,0; 3 -4.191,0; 4 4.191,5.512; 5 0,5.512; 6 -4.191,5.512 | hole 3: -4.191,-7.3; 4.191,-7.3
DPAK = smd 1.6 x 2.997: 1 -2.261,-4.928; 3 2.21,-4.928 | smd 5.452 x 7: 4 0,1.853
TO92-EBC = drill 0.813 long: B 0,-1.27; C -2.54,-1.27; E 2.54,-1.27
QS = drill 0.61 long: 1 -2.54,0; 2 2.54,0
0204/5 = drill 0.813 octagon: 1 -2.54,0; 2 2.54,0
SJW = smd 1.27 x 2.54: 1 -1.27,0; 2 1.27,0
MA03-1 = drill 1.016 long: 1 -2.54,0; 2 0,0; 3 2.54,0
FE08 = drill 0.813 long: 1 -8.89,0; 2 -6.35,0; 3 -3.81,0; 4 -1.27,0; 5 1.27,0; 6 3.81,0; 7 6.35,0; 8 8.89,0
MA07-1 = drill 1.016 long: 1 -7.62,0; 2 -5.08,0; 3 -2.54,0; 4 0,0; 5 2.54,0; 6 5.08,0; 7 7.62,0
QFP80P900X900X120-32N = smd 1.473 x 0.508: 1 -4.242,2.794; 2 -4.242,2.007; 3 -4.242,1.194; 4 -4.242,0.406; 5 -4.242,-0.406; 6 -4.242,-1.194; 7 -4.242,-2.007; 8 -4.242,-2.794; 17 4.242,-2.794; 18 4.242,-2.007; 19 4.242,-1.194; 20 4.242,-0.406; 21 4.242,0.406; 22 4.242,1.194; 23 4.242,2.007; 24 4.242,2.794 | smd 0.508 x 1.473: 9 -2.794,-4.242; 10 -2.007,-4.242; 11 -1.194,-4.242; 12 -0.406,-4.242; 13 0.406,-4.242; 14 1.194,-4.242; 15 2.007,-4.242; 16 2.794,-4.242; 25 2.794,4.242; 26 2.007,4.242; 27 1.194,4.242; 28 0.406,4.242; 29 -0.406,4.242; 30 -1.194,4.242; 31 -2.007,4.242; 32 -2.794,4.242
STM32F103C8T6-MODULE = drill 0.9 long: 3.3V_1 25.4,-7.62; 3.3V_2 -17.78,7.62; 5V 20.32,-7.62; GND_1 22.86,-7.62; GND_2 -20.32,7.62; GND_3 -22.86,7.62; PA_0 15.24,7.62; PA_1 12.7,7.62; PA_2 10.16,7.62; PA_3 7.62,7.62; PA_4 5.08,7.62; PA_5 2.54,7.62; PA_6 0,7.62; PA_7 -2.54,7.62; PA_8 -12.7,-7.62; PA_9 -10.16,-7.62; PA_10 -7.62,-7.62; PA_11 -5.08,-7.62; PA_12 -2.54,-7.62; PA_15 0,-7.62; PB_0 -5.08,7.62; PB_1 -7.62,7.62; PB_3 2.54,-7.62; PB_4 5.08,-7.62; PB_5 7.62,-7.62; PB_6 10.16,-7.62; PB_7 12.7,-7.62; PB_8 15.24,-7.62; PB_9 17.78,-7.62; PB_10 -10.16,7.62; PB_11 -12.7,7.62; PB_12 -22.86,-7.62; PB_13 -20.32,-7.62; PB_14 -17.78,-7.62; PB_15 -15.24,-7.62; PC_13 22.86,7.62; PC_14 20.32,7.62; PC_15 17.78,7.62; RESET -15.24,7.62; VB 25.4,7.62
F50HP = drill 1.016 octagon: 1 -22.073,-2.54; 2 -19.329,-2.54; 3 -16.561,-2.54; 4 -13.792,-2.54; 5 -11.049,-2.54; 6 -8.28,-2.54; 7 -5.512,-2.54; 8 -2.769,-2.54; 9 0,-2.54; 10 2.769,-2.54; 11 5.512,-2.54; 12 8.28,-2.54; 13 11.049,-2.54; 14 13.792,-2.54; 15 16.561,-2.54; 16 19.329,-2.54; 17 22.073,-2.54; 18 -20.701,0; 19 -17.958,0; 20 -15.189,0; 21 -12.421,0; 22 -9.677,0; 23 -6.909,0; 24 -4.14,0; 25 -1.397,0; 26 1.372,0; 27 4.14,0; 28 6.883,0; 29 9.652,0; 30 12.421,0; 31 15.189,0; 32 17.932,0; 33 20.701,0; 34 -22.073,2.54; 35 -19.329,2.54; 36 -16.561,2.54; 37 -13.792,2.54; 38 -11.049,2.54; 39 -8.28,2.54; 40 -5.512,2.54; 41 -2.769,2.54; 42 0,2.54; 43 2.769,2.54; 44 5.512,2.54; 45 8.28,2.54; 46 11.049,2.54; 47 13.792,2.54; 48 16.561,2.54; 49 19.329,2.54; 50 22.073,2.54 | drill 3.302 pad 5.08: G1 -30.556,0; G2 30.556,0

### Placement (x,y rotation side)
1K-1%  58.19,58.35 0 top
3K-1%  58.23,60.84 180 top
C1  120.27,10.69 270 top
C2  31.8,51.49 0 top
C3  69.38,67.49 90 top
C7  40.05,51.49 180 top
C8  31.96,45.41 0 top
C9  39.55,45.31 180 top
C10  58.98,67.67 0 top
C16  142.1,21.34 0 top
C17  130.85,20.68 90 top
C18  139.95,34.83 180 top
C19  143.17,27.57 270 top
C20  31.74,33.77 0 top
C21  39.82,33.48 180 top
C22  57.28,52.96 0 top
C23  65.4,52.96 0 bottom
C24  31.49,39.28 0 top
C25  39.5,39.62 180 top
C26  57.32,47.06 0 top
C27  65.31,47.08 180 top
C28  57.36,40.92 0 top
C29  65.51,40.93 180 top
C30  57.49,34.94 0 top
C31  65.35,34.93 180 top
D1  24.72,9.34 90 top
D2  116.99,9.75 270 top
D3  47.04,54.03 0 top
D4  35.17,9.33 90 top
D5  47.07,48.11 0 top
D6  46.57,9.34 90 top
D7  58.15,9.38 90 top
D8  46.58,36.2 0 top
D9  35.25,74.18 0 top
D10  116.2,82.55 270 top
D12  34.29,88.9 270 top
D13  21.59,88.9 90 top
D14  38.1,88.9 270 top
D15  50.8,88.9 90 top
D16  69.41,9.36 90 top
D17  71.8,53.24 0 top
D18  80.67,9.38 90 top
D19  46.42,42.31 0 top
D20  54.61,88.9 270 top
D21  67.31,88.9 90 top
D22  71.12,88.9 270 top
D23  83.82,88.9 90 top
D24  71.96,49.57 180 bottom
D27  83.19,61.01 0 top
D28  73.85,41.08 0 top
D29  71.7,34.92 0 top
D32  100.33,88.9 270 top
D33  87.63,88.9 90 top
DISPLAY  143.51,82.55 90 top
IC2  144,61.27 0 top
IC3  85.55,43.67 270 top
IC4  47.74,64.86 0 top
IC5  102.8,9.68 180 top
IC8  130.18,82.55 90 top
IC9  139.12,27.15 0 top
IC11  84.45,69.22 270 top
IC12  94.45,58.88 0 top
L1  34.41,66.55 0 top
LED1  21.61,97 270 top
LED2  28.13,97 270 top
LED3  34.41,96.94 270 top
LED4  41.21,96.93 270 top
LED5  48.14,96.92 270 top
P1  39-30-06?  [39-30-?06?]  14.61,15.88 270 top
PROG  112.39,82.55 90 top
Q1  29.88,8.65 180 top
Q2  126.56,5.54 180 top
Q3  41.3,9 180 top
Q4  104.78,77.4 315 top
Q5  52.46,8.96 180 top
Q7  63.78,9.06 180 top
Q9  27.94,88.9 0 top
Q10  44.45,88.9 0 top
Q11  75.2,9.08 180 top
Q13  86.71,9.19 180 top
Q15  60.96,88.9 0 top
Q16  77.47,88.9 0 top
Q17  93.98,88.9 0 top
R1  142.81,52.84 90 top
R2  144.98,52.86 90 top
R3  126.65,14.57 270 top
R4  38.78,54.03 180 top
R5  31.8,54.03 180 top
R6  39.39,48.06 180 top
R7  83.12,58.12 0 top
R8  83.2,56.04 180 top
R9  20.53,93.44 180 top
R10  35.73,93.24 180 top
R11  51.91,93.41 180 top
R12  68.54,93.47 180 top
R13  31.91,48.07 180 top
R14  55.06,96.51 180 top
R16  29.84,78.11 90 top
R17  41.91,78.11 90 top
R18  39.45,36.2 180 top
R19  31.86,36.36 180 top
R20  59.05,77.47 90 top
R21  91.82,78.7 90 top
R22  65.13,55.91 180 top
R23  75.56,79.38 180 top
R24  57.64,55.8 180 top
R25  135.27,27.2 270 top
R26  135.91,21.6 180 top
R27  135.92,19.45 180 top
R28  132.85,26.8 90 bottom
R29  145.65,27.64 270 top
R30  140.98,32.31 180 top
R35  39.31,42.22 180 top
R36  31.82,42.42 180 top
R37  65.31,49.68 180 top
R38  57.65,49.74 180 top
R39  65.5,43.79 180 top
R40  57.67,43.77 180 top
R41  65.3,37.63 180 top
R42  57.67,37.58 180 top
SJ1  130.5,77.08 0 top
SV1  132.92,14.06 0 top
SV2  132.75,38.48 0 top
SV3  75.84,64.88 90 top
SV4  25.4,66.67 270 top
U1  104.02,67.43 225 top
U$2  129.54,73.66 270 top
X2  12.7,59.69 90 top

### Tracks (layer width: path | path; a pad name or v marks a point on that pad's centre or on a via)
3V3
  Top 0.406: U$2.3.3V_1 126.55,48.26 134.53,56.24 134.53,61.64 135.16,62.27 140.5,62.27 IC2.8
5V  (via drill 0.35, 0.45, 0.65)  (5 unrouted)
  Top 0.305: U1.18 101.97,68.21 103.75,68.21 | 103.75,68.21 105.38,68.21 U1.4 109.25,72.08 | 103.75,68.21 103.75,68.85 U1.6 106.99,72.08 | U1.20 103.75,67.73 103.75,68.21 | IC12.16 89.91,62.05 v88.27,62.05 87.67,62.05 85.79,63.92 85.79,72.73 86.73,73.66 IC11.16
  Top 0.406: 87.53,73.87 IC11.16
  Top 0.61: R24.1 60.18,58.98 3K-1%.1 57.2,65.68 C10.+ | v82.39,79.01 87.53,73.87 | D10.A 116.2,76.88 111.41,72.08 109.25,72.08 106.99,72.08 | IC11.16 94.98,73.66 97.49,76.16 100.46,76.16 v100.5,76.2
  Top 0.813: R5.1 34.34,54.5 39.41,59.58 L1.2
  Bottom 0.305: R5.1 34.34,48.19 R13.1 | 88.27,62.03 v88.27,62.05
  Bottom 0.406: R13.1 34.45,47.82 34.45,42.51 R36.1 | R24.1 R38.1 60.19,43.79 | 76.26,73.77 SV3.8 | 82.36,79.01 v82.39,79.01
  Bottom 0.61: R5.1 34.45,53.92 34.45,47.82 | R13.1 34.45,42.51 | R36.1 34.4,42.39 R19.1 | R24.1 60.19,55.79 | 60.19,43.79 R40.1 R42.1 | C10.+ 61.73,72.2 65.13,72.2 66.71,73.77 SV3.8 | 82.36,79.01 77.13,73.77 76.26,73.77 | v100.5,76.2 103.67,76.2 105.17,77.7 109.39,77.7 110.7,76.39 113.86,76.39 D10.A
  Bottom 1.016: L1.2 56.09,66.55 C10.+
5V1  (via drill 0.45)
  Top 0.305: v124.46,80.64 IC8.8
  Bottom 0.406: PROG.4 D10.C 116.2,92.29 110.25,98.25 48.19,98.25 LED5.A LED4.A 34.42,98.2 LED3.A 28.19,98.21 LED2.A LED1.A | v124.46,80.64 124.46,81.5 125.7,82.75
  Bottom 0.61: U$2.5V 122.99,53.34 125.7,56.05 125.7,82.75 125.7,83.4 124.06,85.03 117.53,85.03 D10.C
A  (1 unrouted)
A0  (1 unrouted)
A1
  Top 0.406: U$2.PA_0 137.41,58.67 IC2.1 IC2.2
ACC  (via drill 0.9, 1)  (1 unrouted)
  Top 0.813: v19.05,88.9 21.05,86.9 D13.C | v50.8,83.82 D15.C | v67.31,83.82 D21.C | v83.82,83.82 D23.C D33.C | v41.38,60.25 42.56,59.07 IC4.1
  Bottom 0.406: C3.+ 71,67.33 79.88,67.33 82.89,64.33 82.89,60.89 R7.2
  Bottom 0.813: X2.50 17.3,88.9 v19.05,88.9 48.26,88.9 | 48.26,88.9 50.8,86.36 v50.8,83.82 | 48.26,88.9 66.04,88.9 | 66.04,88.9 67.31,87.63 v67.31,83.82 | 66.04,88.9 82.55,88.9 83.82,87.63 v83.82,83.82 83.82,77.21 77.84,71.23 SV3.7 74.06,71.23 72.56,69.73 72.56,68.89 C3.+ 66.49,62.82 43.95,62.82 v41.38,60.25
AIN0
  Top 0.406: C2.1 31.8,52.76 | 31.8,52.76 34.97,52.76 R4.2 | 31.8,52.76 30.52,54.03 R5.2 26.65,54.03 21.85,58.84 21.85,65.99 17.1,70.74 X2.13
AIN1
  Top 0.305: R13.2 30.69,46.75 30.69,46.59 | 30.69,46.59 C8.1 | 30.69,46.59 31.04,46.94 36.22,46.94 36.85,47.57 R6.2
  Bottom 0.406: X2.29 18.6,69.34 21.55,66.39 21.55,57.64 29.37,49.83 R13.2
AIN2
  Top 0.406: R36.2 30.82,40.88 | C24.1 30.67,39.73 30.67,40.88 30.82,40.88 | 30.82,40.88 35.5,40.88 36.77,42.16 R35.2
  Bottom 0.406: R36.2 27.87,43.84 27.87,49.24 20.41,56.7 20.41,65.01 18.88,66.55 14.75,66.55
AIN3
  Top 0.406: R19.2 30.47,35.2 | 30.47,35.2 C20.1 | 30.47,35.2 30.65,35.02 35.73,35.02 R18.2
  Bottom 0.406: R19.2 26.76,38.92 26.76,48.25 19.34,55.67 19.34,61.44 18.15,62.63 17.08,62.63
AIN4
  Top 0.406: R24.2 55.34,55.8 56.52,54.61 57.66,54.61 | R22.2 61.3,54.61 57.66,54.61 | 57.66,54.61 C22.1 50.3,52.95 47.02,49.67 29.59,49.67 21.24,58.02 21.24,65.09 18.36,67.97 X2.12
AIN5
  Top 0.406: R37.2 61.52,48.42 57.62,48.42 | 57.62,48.42 56.26,47.06 C26.1 | 57.62,48.42 56.42,48.42 R38.2 53.24,47.88 51.76,47.88 47.37,43.49 30.55,43.49 28.11,45.92 28.11,49.38 20.41,57.08 20.41,63.67 18.88,65.2 17.57,65.2
AIN6
  Top 0.406: 57.4,42.49 57.4,42.23 C28.1 | 57.4,42.49 56.09,42.49 55.13,43.45 R40.2 53.86,43.77 47.78,37.69 27.48,37.69 26.65,38.53 26.65,49.12 19.62,56.15 19.62,61.89 17.75,63.76 14.44,63.76 14.39,63.72 | 57.4,42.49 61.65,42.49 R39.2
AIN7
  Top 0.406: R42.2 56.38,36.33 57.62,36.33 | R41.2 61.47,36.33 57.62,36.33 | C30.1 57.62,36.33
  Bottom 0.406: R42.2 52.45,34.9 29.08,34.9 26.11,37.87 26.11,47.52 18.72,54.91 18.72,59.6 17.12,61.21 14.99,61.21
AOUT0  (via drill 0.35)
  Top 0.406: C7.1 R4.1 D3.C | IC3.2 77.73,49.38 76,51.12 53.53,51.12 52.96,50.54 v52.96,50.52
  Bottom 0.406: v52.96,50.52 48.01,50.52 D3.C
AOUT1  (via drill 0.35)
  Top 0.305: C9.1 40.82,46.95 R6.1 44.48,48.06 D5.C
  Top 0.406: IC3.3 73.46,48.11 71.14,45.8 52.96,45.8 52.55,46.21 v52.18,46.21
  Bottom 0.406: v52.18,46.21 46.43,46.21 D5.C
AOUT2  (via drill 0.35)
  Top 0.406: C25.1 40.77,41.13 R35.1 43.79,42.22 D19.C | IC3.4 73.84,46.84 72.01,45.02 53.08,45.02 52.91,45.02 52.58,45.02 v52.24,44.67
  Bottom 0.406: v52.24,44.67 46.24,44.67 D19.C
AOUT3  (via drill 0.35)
  Top 0.406: C21.1 41.09,35.31 R18.1 D8.C | v53.09,39 67.53,39 72.42,43.9 72.54,43.9 74.22,45.57 IC3.5
  Bottom 0.406: D8.C 46.88,39.03 53.06,39.03 v53.09,39
AOUT4  (via drill 0.4)
  Top 0.406: R22.1 67.67,53.96 | 67.67,53.96 67.67,53.93 68.36,53.24 D17.C | C23.1 67.67,53.96 | IC3.6 77,44.3 v76.96,44.35
  Bottom 0.406: v76.96,44.35 75.69,45.62 72.58,45.62 71.35,46.85 71.35,51.38 69.49,53.24 D17.C
AOUT5  (via drill 0.4)
  Top 0.406: C27.1 67.85,48.36 R37.1 | IC3.7 78.25,43.03 v78.17,43.11
  Bottom 0.305: 69.21,46.23 67.85,47.59 R37.1 69.31,49.68 D24.C
  Bottom 0.406: v78.17,43.11 72.34,43.11 69.21,46.23
AOUT6
  Top 0.406: R39.1 68.04,42.13 66.84,40.93 C29.1 | IC3.8 77.48,41.76 76.6,42.65 72.88,42.65 D28.C
  Bottom 0.406: R39.1 70.75,41.08 D28.C
AOUT7
  Top 0.406: 67.84,36.24 R41.1 74.97,37.63 77.83,40.49 IC3.9 | 67.84,36.24 D29.C | C31.1 67.84,36.15 67.84,36.24
B  (1 unrouted)
C  (1 unrouted)
CKPOUT  (1 unrouted)
D  (1 unrouted)
ECN1
  Top 1.27: Q11.4 72.36,7.23 D16.C
  Bottom 1.27: P1.5 26.78,9.21 57.4,9.21 62.33,4.28 D16.C
ECN1L  (1 unrouted)
ECN2
  Top 1.27: Q13.4 85.11,7.34 82.07,4.3 D18.C
  Bottom 1.27: P1.6 22.98,20.07 32.31,10.74 58.4,10.74 63.12,6.01 77.95,6.01 79.66,4.3 D18.C
ECN2L  (1 unrouted)
GNC/GLP_MODE  (1 unrouted)
GND  (via drill 0.35, 0.45, 0.55)  (1 unrouted)
  Top 0.203: D9.A 37.25,73.24 38.25,72.24 v38.86,72.24
  Top 0.254: Q15.3 64.44,83.97 65.17,83.24 v65.17,79.99
  other vias: 8.89,97.79 135.89,7.62 71.28,3.24 24.16,81.08 35.63,81.01 46.76,80.47 55.66,80.18 36.83,3.81
  pour Top: 0,100.33 0,2.54 2.54,0 148.59,0 149.86,1.27 149.86,91.44 140.97,100.33
  pour Bottom: 7.62,99.06 0,91.44 0,7.62 7.62,0 142.24,0 149.86,7.62 149.86,91.44 142.24,99.06
IAC_A
  Top 0.61: X2.14 18.27,73.48 25.08,66.67 SV4.4
IAC_B
  Top 0.61: X2.31 18.47,74.88 24.13,69.22 SV4.3
IAC_C
  Bottom 0.61: X2.48 10.21,76.2 13.32,76.2 14.6,74.93 19.76,74.93 22.94,71.75 SV4.2
IAC_D
  Top 0.61: X2.15 18.41,76.25 20.37,74.3 SV4.1
INY1
  Top 1.27: D1.C 24.72,4.38 27.14,6.79 Q1.4
  Bottom 1.27: P1.1 22.03,4.26 D1.C
INY2
  Top 1.27: D4.C 35.17,4.39 37.93,7.15 Q3.4
  Bottom 1.27: P1.2 12.04,13.31 12.04,9.29 18.96,2.37 33.28,2.37 D4.C
INY3
  Top 1.27: Q5.4 49.46,7.11 46.61,4.26 D6.C 44.39,2.08 23.9,2.08 17.25,8.72 17.25,17.42 P1.3
INY4
  Top 1.27: Q7.4 61.06,7.21 D7.C
  Bottom 1.27: P1.4 24.09,7.71 54.74,7.71 D7.C
INYL1A  (1 unrouted)
INYL2A  (1 unrouted)
INYL3A  (1 unrouted)
INYL4A  (1 unrouted)
L5  (1 unrouted)
LAMB0OUT  (1 unrouted)
  Top 0.305: C17.1 133.33,19.41 R27.2 134.23,19.45 137.21,22.44 IC9.1
LAMB1OUT  (1 unrouted)
  Top 0.305: R30.2 138.44,29.79 IC9.7
  Bottom 0.305: R30.2 141.91,28.84 C19.1
M1  (via drill 0.35)
  Top 0.305: IC11.15 v89.71,72.39 v89.72,72.38
  Bottom 0.305: v89.72,72.38 81.48,72.38 77.79,68.69 SV3.6
M2
  Top 0.305: IC11.1 79.15,73.66 77.97,72.48 77.97,68.28 SV3.5
M3
  Top 0.305: IC11.2 79.33,72.39 78.67,71.73 78.67,66.44 SV3.4
M4
  Top 0.305: SV3.3 79.34,64.57 79.34,70.14 80.32,71.12 IC11.3
MISO  (via drill 0.35)
  Top 0.305: U$2.PB_6 116.05,63.5 111.31,68.24 v111.28,68.24 | v97.67,68.36 97.76,68.45 U1.16
  Bottom 0.305: v111.28,68.24 111.26,68.26 102.86,68.26 101.38,66.78 99.48,66.78 97.9,68.36 v97.67,68.36
MOSI  (via drill 0.35)
  Top 0.305: U1.15 98.38,70.23 v98.31,70.23
  Bottom 0.305: v98.31,70.23 111.94,70.23 121.21,60.96 U$2.PB_7
N$1
  Top 0.305: C18.1 141.22,32.69 141.12,32.59 141.12,29.85 IC9.5
  Bottom 0.305: R28.2 132.85,30.85 135.37,33.37 139.76,33.37 C18.1
N$2  (via drill 0.6)
  Top 0.508: Q1.1 30.44,15.28 v30.44,16.01
  Bottom 0.508: v30.44,16.01 30.44,15.29 33.43,12.29 59.5,12.29 63,8.8 104.45,8.8 IC5.2
N$3  (via drill 0.6)
  Top 0.508: v43.53,16.56 43.56,16.52 Q3.1
  Bottom 0.508: IC5.4 100.16,9.59 63.21,9.59 59.8,13 44.71,13 43.53,14.18 v43.53,16.56
N$4
  Top 0.406: Q9.1 29.01,80.64 R16.2
N$5  (via drill 0.45)
  Top 0.508: Q5.1 57.09,16.25 v63.65,16.25
  Bottom 0.508: v63.65,16.25 63.65,12.65 65.69,10.61 96.1,10.61 IC5.6
N$6
  Top 0.508: Q7.1 66.81,13.99 67.61,13.18 67.61,3.59 69.54,1.67 94.41,1.67 96.45,3.7 IC5.10
N$7
  Top 0.406: Q17.1 91.82,83.87 R21.2
N$8
  Top 0.406: R17.2 41.91,83.69 Q10.1
N$9  (via drill 0.6)
  Top 0.508: Q11.1 78.04,14.01 78.96,13.09 78.96,3.56 79.83,2.69 v89.16,2.69
  Bottom 0.508: v89.16,2.69 90.39,3.92 101.26,3.92 101.53,4.18 IC5.12
N$10  (via drill 0.6)
  Top 0.508: Q13.1 89.8,14.12 90.68,13.23 90.68,3.87 91.86,2.69 v92.83,2.69
  Bottom 0.508: v92.83,2.69 105.96,2.69 IC5.15
N$11
  Top 0.406: IC2.3 144.63,56.51 | 144.63,56.51 144.63,55.74 R2.2 | R1.2 143.93,56.51 144.63,56.51
N$12
  Bottom 0.305: LED1.K 20.28,95.73 R9.2
N$13
  Bottom 0.305: LED2.K 30.61,93.24 R10.2
N$14  (1 unrouted)
N$15
  Bottom 0.305: R11.2 40.83,93.41 38.57,95.67 LED3.K
N$16
  Bottom 0.305: LED4.K 42.36,94.51 64.96,94.51 R12.2
N$17
  Bottom 0.305: LED5.K 51.66,95.65 R14.2
N$18_P
  Top 0.406: Q4.2 107.15,75.03 107.15,73.39 U1.7
N$19
  Top 0.406: Q15.1 58.7,80.37 R20.2
N$20_N
  Top 0.406: Q4.1 103.01,79.19 104.27,77.93 104.27,73.18 U1.8
N$25
  Top 0.406: IC11.9 91.34,64.77 92.55,63.56 IC12.14
N$29
  Top 0.406: R23.2 75.21,81.56 Q16.1
N$31
  Top 0.305: IC9.3 139.75,22.42 C16.1
  Bottom 0.305: R25.2 137.51,24.66 C16.1
N$32
  Top 0.305: R26.1 138.45,24.52 IC9.2
  Bottom 0.305: R27.1 138.45,19.46 R26.1
N$34
  Top 0.305: IC8.7 128.54,81.92 129.64,80.82 129.64,77.48 SJ1.1
N$35  (via drill 0.35)
  other vias: 119.38,82.55
N$36  (via drill 0.35)
  other vias: 116.84,82.55
N$37
  Top 0.305: R30.1 143.52,32.3 R29.1 145.69,30.13 145.69,28.99 144.27,27.56 140.55,27.56 139.75,28.36 IC9.6
N$38  (via drill 0.35)
  other vias: 114.3,82.55
N$39  (via drill 0.35)
  other vias: 119.38,80.01
N$40  (via drill 0.35)
  other vias: 114.3,80.01
N$41  (via drill 0.35)
  other vias: 114.3,85.09
N$42  (via drill 0.35)
  other vias: 138.43,85.09
N$43  (via drill 0.35)
  other vias: 142.24,85.09
N$44  (via drill 0.35)
  other vias: 140.23,86.41
N$45  (via drill 0.35)
  other vias: 140.46,83.82
N$51  (via drill 0.45)
  other vias: 34.34,66.41
N$53  (via drill 0.45)
  other vias: 39.45,73.94
N$91  (via drill 0.6)
  Top 0.813: v46.09,56.72 46.09,59.02 IC4.2
  Top 1.27: L1.1 33.25,70.39 D9.C
  Bottom 0.813: L1.1 37.54,58.42 41.71,58.42 43.41,56.72 v46.09,56.72
N$92  (via drill 0.6)
  Top 0.61: v52.42,57.15 50.11,57.15 49.44,57.83 IC4.4 | 3K-1%.2 54.42,58.39 1K-1%.1
  Bottom 0.61: 3K-1%.2 54.24,60.84 52.95,59.55 52.95,57.69 v52.42,57.15
PWM  (via drill 0.35)
  Top 0.406: SV4.7 32.38,59.05 v36.83,63.5 | v64.74,64.24 69.17,59.81 86.95,59.81 88.3,58.46 94.71,58.46 98.52,58.46 100.45,60.39 v100.45,60.5 | v110.7,65.95 110.7,66.78 109.02,68.45 U1.1
  Bottom 0.406: v36.83,63.5 40.64,63.5 41.99,64.85 64.13,64.85 v64.74,64.24 | v100.45,60.5 105.9,65.95 v110.7,65.95
RCK
  Top 0.305: U1.11 100.9,72.24 98.78,72.24 94.97,68.43 94.97,65.77
  Top 0.406: IC12.12 95.09,65.65 94.97,65.77 92.15,68.58 IC11.12
RL1
  Top 0.305: R16.1 39.68,75.56 40.89,74.35 55.19,74.35 56.53,73.01 64.44,73.01 66.91,75.48 82,75.48 83.19,74.3 83.19,70.48 82.55,69.85 IC11.4
RL1IN
  Top 0.61: D13.A 18.51,90.9 16.51,88.9 16.51,83.03 X2.17
  Top 0.813: D13.A 27.4,90.9 27.94,91.44 Q9.4 28.09,90.9 D12.C
RL2
  Top 0.305: R17.1 42.02,75.46 55.64,75.46 57.32,73.79 63.62,73.79 65.85,76.02 82.33,76.02 83.8,74.55 83.8,69.83 82.55,68.58 IC11.5
RL2IN  (via drill 0.85)
  Top 0.61: v40.01,84.45 40.01,85.82 45.09,90.9
  Top 0.813: D14.C 44.3,90.9 | 44.3,90.9 45.09,90.9 D15.A | 44.3,90.9 Q10.4
  Bottom 0.61: X2.33 18.16,80.39 25.4,87.63 39.37,87.63 40.01,87 v40.01,84.45
RL3
  Top 0.305: R20.1 59.37,74.61 63.28,74.61 65.26,76.59 82.53,76.59 84.45,74.67 84.45,68.57 83.19,67.31 IC11.6
RL3IN  (via drill 0.85)
  Top 0.61: v55.52,84.1 62.33,90.9
  Top 0.813: D20.C 60.81,90.9 | 60.81,90.9 62.33,90.9 | 60.81,90.9 Q15.4 61.11,90.9 D21.A
  Bottom 0.61: v55.52,84.1 50.44,79.02 X2.16
RL4
  Top 0.305: R23.1 80.64,79.38 85.09,74.93 85.09,67.21 83.92,66.04 IC11.7
RL4IN  (via drill 0.85)
  Top 0.61: v72.39,83.19 72.39,84.45 77.47,89.53 Q16.4
  Top 0.813: D22.C 76.93,90.9 77.47,91.44 Q16.4 83.67,90.75 D23.A
  Bottom 0.61: X2.49 13.27,79.02 14.59,77.71 66.91,77.71 v72.39,83.19
RL5  (1 unrouted)
RL5IN  (via drill 0.85)  (1 unrouted)
  Top 0.61: X2.32 20.04,77.62 v21.27,76.39 | 95.08,90.9 85.51,81.34 v82.17,81.34
  Top 0.813: D33.A 95.08,90.9 | 93.83,90.9 Q17.4 100.18,90.75 D32.C
  Bottom 0.61: v21.27,76.39 21.47,76.39 21.85,76.77 77.6,76.77 v82.17,81.34
RX
  Bottom 0.406: PROG.3 U$2.PA_9
SCK  (via drill 0.35)
  Top 0.305: U$2.PB_5 114.79,66.04 111.61,69.22 v111.61,69.25 | v100.77,68.15 100.77,68.08 99.09,66.41 U1.17
  Bottom 0.305: v111.61,69.25 101.97,69.25 100.87,68.15 v100.77,68.15
SCK2  (via drill 0.35)
  Top 0.305: U1.10 101.53,72.75 97.74,72.75 93.81,68.82 93.68,68.82 v93.65,68.79
  Top 0.406: IC11.11 87.55,67.29 90.75,67.29 93.35,64.69 v93.89,64.69 | v96.35,64.45 96.36,64.44 IC12.11
  Bottom 0.305: v93.65,68.79 93.65,64.92 v93.89,64.69
  Bottom 0.406: v93.89,64.69 96.11,64.69 v96.35,64.45
SCL  (via drill 0.65)
  Top 0.406: v129.88,83.25 129.81,83.19 IC8.6
  Bottom 0.406: DISPLAY.4 141.6,86.36 139.06,83.82 U$2.PB_10 130.45,83.82 v129.88,83.25
SDA
  Top 0.305: U$2.PB_11 129.48,86.36 IC8.5
  Top 0.406: U$2.PB_11 139.06,86.36 141.6,83.82 DISPLAY.3
SER
  Top 0.305: IC11.14 94.55,71.12 96.82,73.39 102.01,73.39 U1.9
SS  (via drill 0.35)
  Top 0.305: U1.14 99.13,70.64 v99.13,71.27
  Bottom 0.305: v99.13,71.27 113.9,71.27 116.59,68.58 U$2.PB_4
TPSM_A
  Bottom 0.61: X2.30 18.75,72.11 22.56,68.3 22.56,63.21 24.18,61.59 SV4.6
TPSM_B
  Top 0.61: X2.47 13.27,73.48 14.7,72.06 17.48,72.06 22.86,66.67 22.86,65.41 24.13,64.14 SV4.5
TX
  Bottom 0.406: U$2.PA_10 PROG.2
VBAT
  Top 0.406: IC3.21 87.42,46.84 83.68,50.58 83.68,53.95 81.59,56.04 R8.2
  Bottom 0.406: R8.2 80.66,58.03 R7.1 80.58,60.94 D27.C
(copper drawn outside any net)
  shapes: Top area x1